# Altium project ELC102 - Scoreboard.PrjPcb (part 3 of 3)

## Sheet ELC102 - Red Digits.SchDoc: ELC102 - NEOS Scoreboard
size C
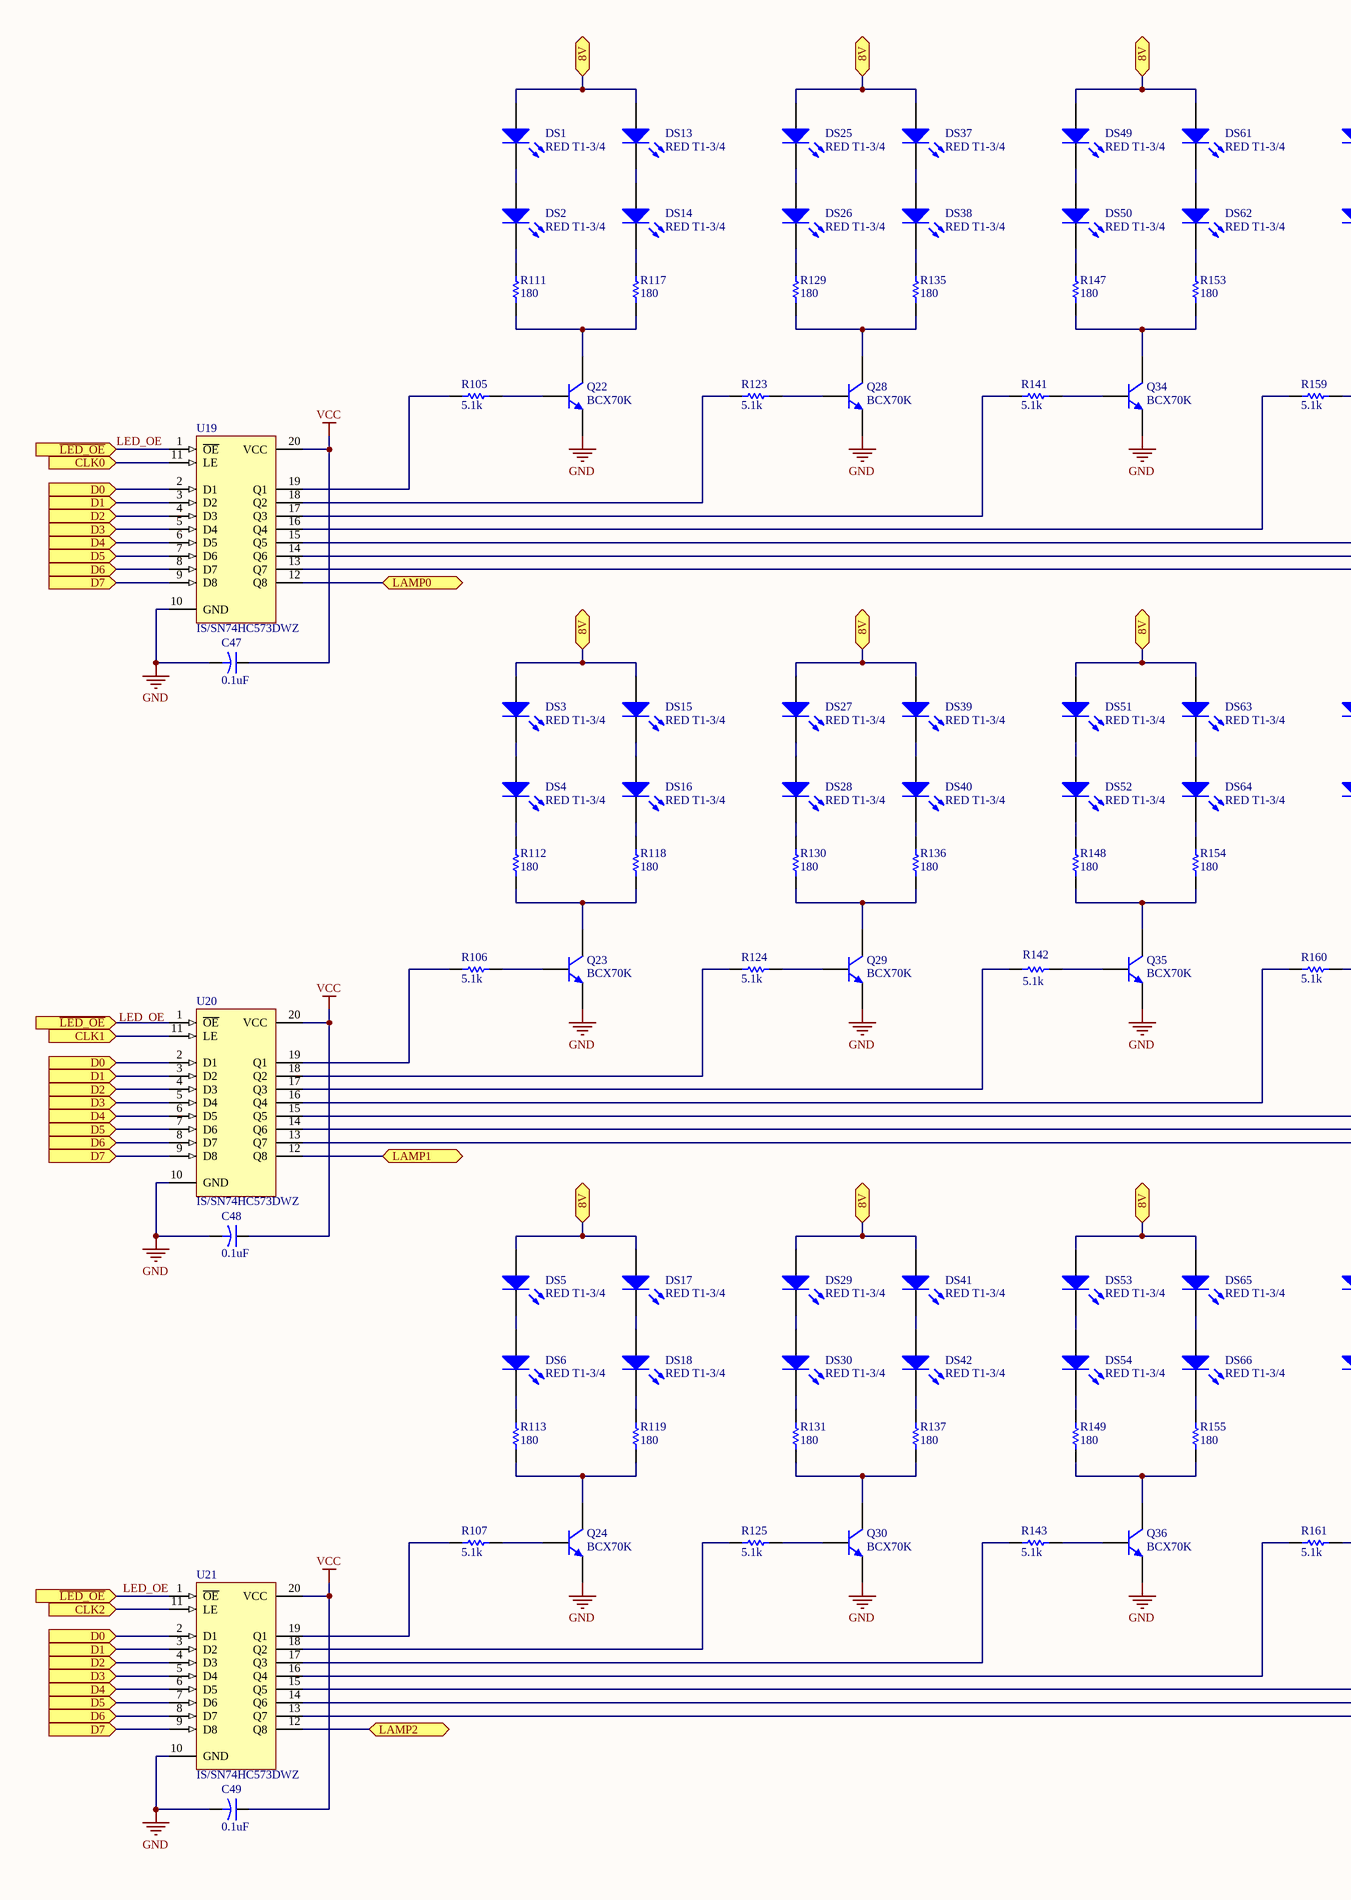
[diagram p6: ELC102 - Red Digits.SchDoc, left]
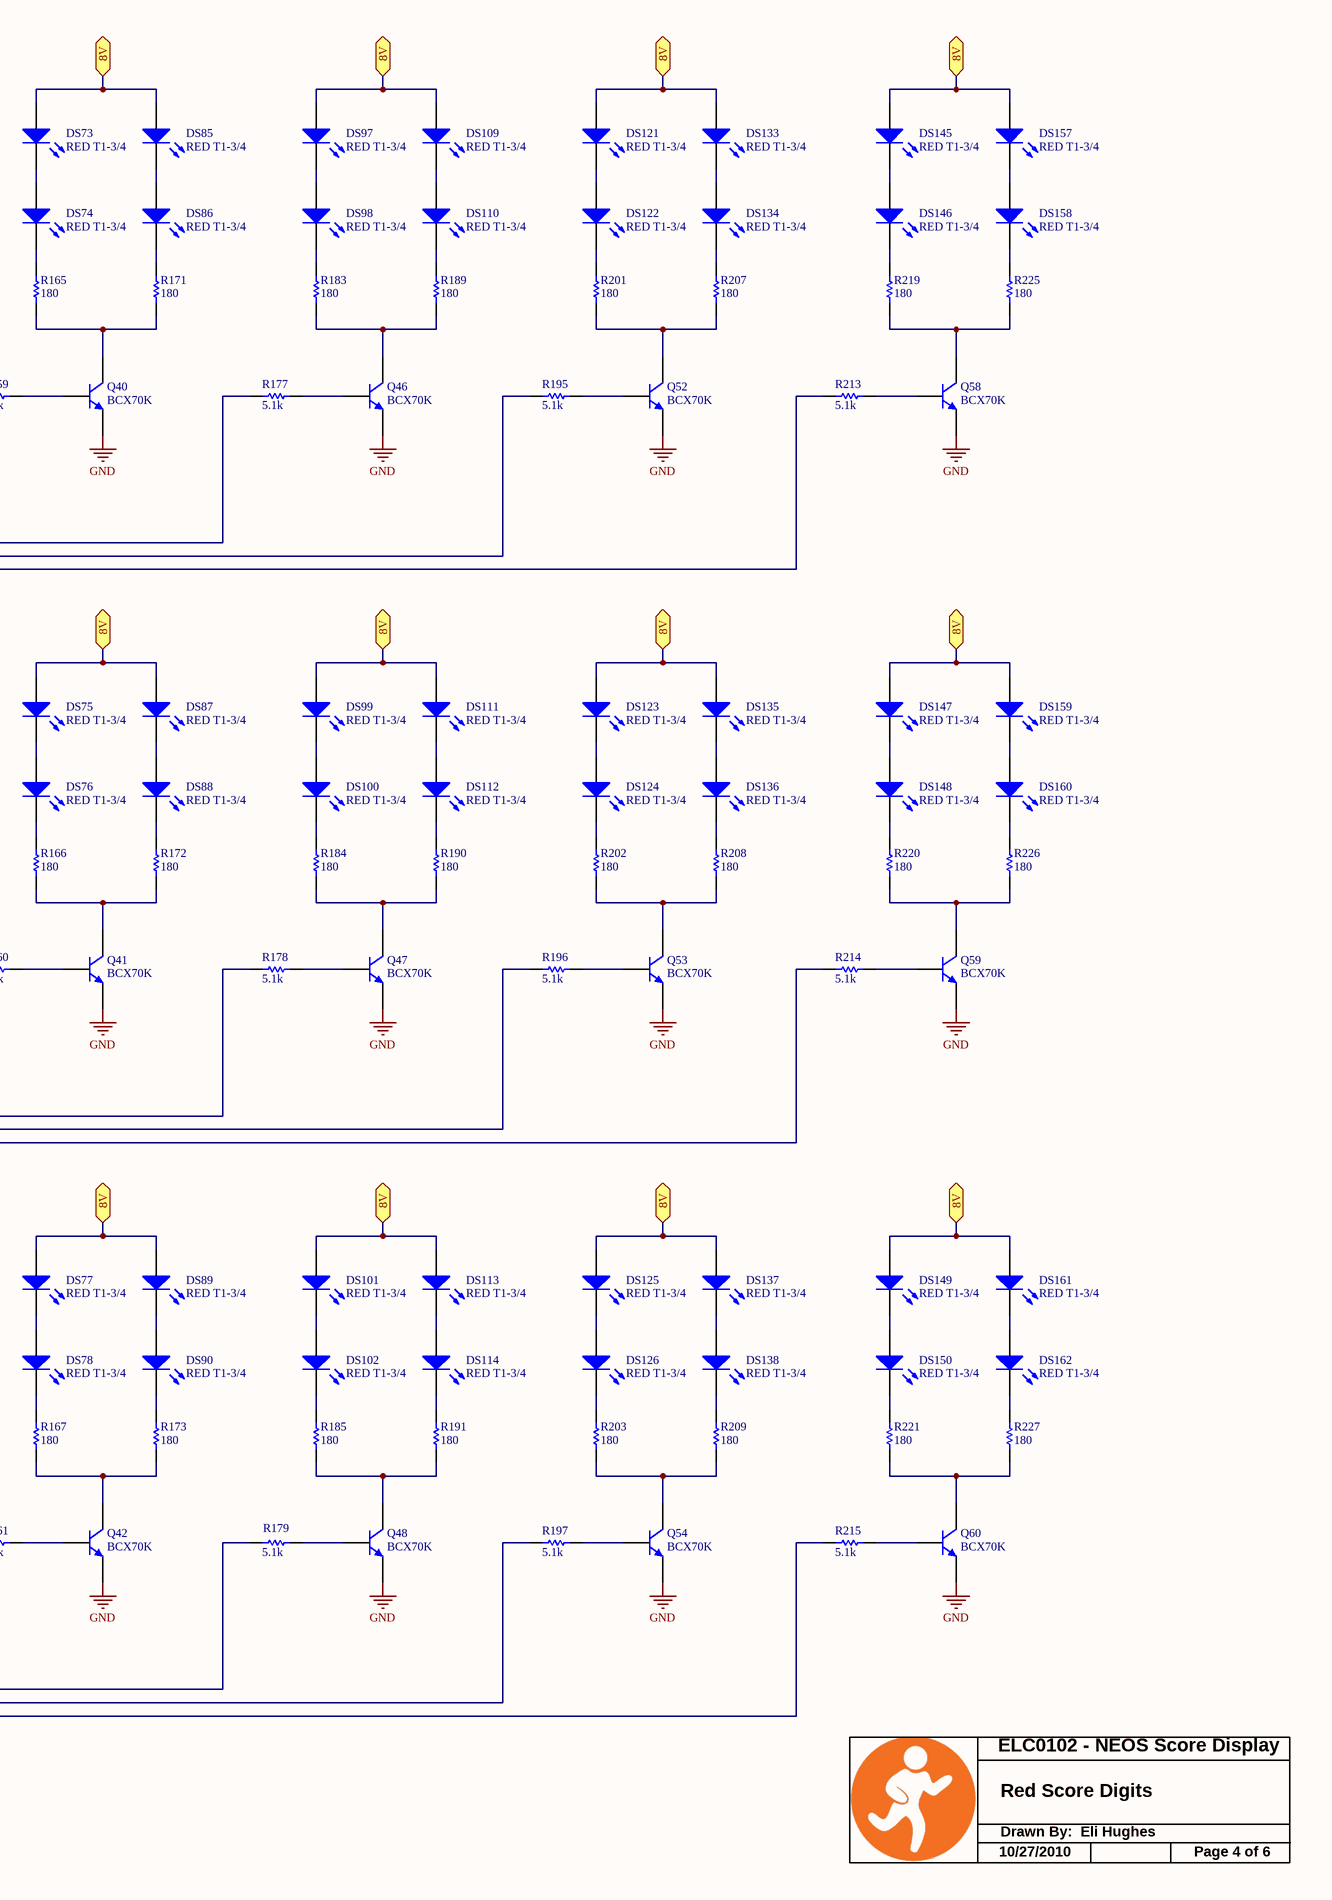
[diagram p7: ELC102 - Red Digits.SchDoc, right]

### Parts
C47  0.1uF  [C0805]
C48  0.1uF  [C0805]
C49  0.1uF  [C0805]
DS1  RED T1-3/4  [LED T1-3/4 Flush]
DS2  RED T1-3/4  [LED T1-3/4 Flush]
DS3  RED T1-3/4  [LED T1-3/4 Flush]
DS4  RED T1-3/4  [LED T1-3/4 Flush]
DS5  RED T1-3/4  [LED T1-3/4 Flush]
DS6  RED T1-3/4  [LED T1-3/4 Flush]
DS13  RED T1-3/4  [LED T1-3/4 Flush]
DS14  RED T1-3/4  [LED T1-3/4 Flush]
DS15  RED T1-3/4  [LED T1-3/4 Flush]
DS16  RED T1-3/4  [LED T1-3/4 Flush]
DS17  RED T1-3/4  [LED T1-3/4 Flush]
DS18  RED T1-3/4  [LED T1-3/4 Flush]
DS25  RED T1-3/4  [LED T1-3/4 Flush]
DS26  RED T1-3/4  [LED T1-3/4 Flush]
DS27  RED T1-3/4  [LED T1-3/4 Flush]
DS28  RED T1-3/4  [LED T1-3/4 Flush]
DS29  RED T1-3/4  [LED T1-3/4 Flush]
DS30  RED T1-3/4  [LED T1-3/4 Flush]
DS37  RED T1-3/4  [LED T1-3/4 Flush]
DS38  RED T1-3/4  [LED T1-3/4 Flush]
DS39  RED T1-3/4  [LED T1-3/4 Flush]
DS40  RED T1-3/4  [LED T1-3/4 Flush]
DS41  RED T1-3/4  [LED T1-3/4 Flush]
DS42  RED T1-3/4  [LED T1-3/4 Flush]
DS49  RED T1-3/4  [LED T1-3/4 Flush]
DS50  RED T1-3/4  [LED T1-3/4 Flush]
DS51  RED T1-3/4  [LED T1-3/4 Flush]
DS52  RED T1-3/4  [LED T1-3/4 Flush]
DS53  RED T1-3/4  [LED T1-3/4 Flush]
DS54  RED T1-3/4  [LED T1-3/4 Flush]
DS61  RED T1-3/4  [LED T1-3/4 Flush]
DS62  RED T1-3/4  [LED T1-3/4 Flush]
DS63  RED T1-3/4  [LED T1-3/4 Flush]
DS64  RED T1-3/4  [LED T1-3/4 Flush]
DS65  RED T1-3/4  [LED T1-3/4 Flush]
DS66  RED T1-3/4  [LED T1-3/4 Flush]
DS73  RED T1-3/4  [LED T1-3/4 Flush]
DS74  RED T1-3/4  [LED T1-3/4 Flush]
DS75  RED T1-3/4  [LED T1-3/4 Flush]
DS76  RED T1-3/4  [LED T1-3/4 Flush]
DS77  RED T1-3/4  [LED T1-3/4 Flush]
DS78  RED T1-3/4  [LED T1-3/4 Flush]
DS85  RED T1-3/4  [LED T1-3/4 Flush]
DS86  RED T1-3/4  [LED T1-3/4 Flush]
DS87  RED T1-3/4  [LED T1-3/4 Flush]
DS88  RED T1-3/4  [LED T1-3/4 Flush]
DS89  RED T1-3/4  [LED T1-3/4 Flush]
DS90  RED T1-3/4  [LED T1-3/4 Flush]
DS97  RED T1-3/4  [LED T1-3/4 Flush]
DS98  RED T1-3/4  [LED T1-3/4 Flush]
DS99  RED T1-3/4  [LED T1-3/4 Flush]
DS100  RED T1-3/4  [LED T1-3/4 Flush]
DS101  RED T1-3/4  [LED T1-3/4 Flush]
DS102  RED T1-3/4  [LED T1-3/4 Flush]
DS109  RED T1-3/4  [LED T1-3/4 Flush]
DS110  RED T1-3/4  [LED T1-3/4 Flush]
DS111  RED T1-3/4  [LED T1-3/4 Flush]
DS112  RED T1-3/4  [LED T1-3/4 Flush]
DS113  RED T1-3/4  [LED T1-3/4 Flush]
DS114  RED T1-3/4  [LED T1-3/4 Flush]
DS121  RED T1-3/4  [LED T1-3/4 Flush]
DS122  RED T1-3/4  [LED T1-3/4 Flush]
DS123  RED T1-3/4  [LED T1-3/4 Flush]
DS124  RED T1-3/4  [LED T1-3/4 Flush]
DS125  RED T1-3/4  [LED T1-3/4 Flush]
DS126  RED T1-3/4  [LED T1-3/4 Flush]
DS133  RED T1-3/4  [LED T1-3/4 Flush]
DS134  RED T1-3/4  [LED T1-3/4 Flush]
DS135  RED T1-3/4  [LED T1-3/4 Flush]
DS136  RED T1-3/4  [LED T1-3/4 Flush]
DS137  RED T1-3/4  [LED T1-3/4 Flush]
DS138  RED T1-3/4  [LED T1-3/4 Flush]
DS145  RED T1-3/4  [LED T1-3/4 Flush]
DS146  RED T1-3/4  [LED T1-3/4 Flush]
DS147  RED T1-3/4  [LED T1-3/4 Flush]
DS148  RED T1-3/4  [LED T1-3/4 Flush]
DS149  RED T1-3/4  [LED T1-3/4 Flush]
DS150  RED T1-3/4  [LED T1-3/4 Flush]
DS157  RED T1-3/4  [LED T1-3/4 Flush]
DS158  RED T1-3/4  [LED T1-3/4 Flush]
DS159  RED T1-3/4  [LED T1-3/4 Flush]
DS160  RED T1-3/4  [LED T1-3/4 Flush]
DS161  RED T1-3/4  [LED T1-3/4 Flush]
DS162  RED T1-3/4  [LED T1-3/4 Flush]
Q22  BCX70K  [SOT23]
Q23  BCX70K  [SOT23]
Q24  BCX70K  [SOT23]
Q28  BCX70K  [SOT23]
Q29  BCX70K  [SOT23]
Q30  BCX70K  [SOT23]
Q34  BCX70K  [SOT23]
Q35  BCX70K  [SOT23]
Q36  BCX70K  [SOT23]
Q40  BCX70K  [SOT23]
Q41  BCX70K  [SOT23]
Q42  BCX70K  [SOT23]
Q46  BCX70K  [SOT23]
Q47  BCX70K  [SOT23]
Q48  BCX70K  [SOT23]
Q52  BCX70K  [SOT23]
Q53  BCX70K  [SOT23]
Q54  BCX70K  [SOT23]
Q58  BCX70K  [SOT23]
Q59  BCX70K  [SOT23]
Q60  BCX70K  [SOT23]
R105  5.1k  [R0805]
R106  5.1k  [R0805]
R107  5.1k  [R0805]
R111  180  [R1206]
R112  180  [R1206]
R113  180  [R1206]
R117  180  [R1206]
R118  180  [R1206]
R119  180  [R1206]
R123  5.1k  [R0805]
R124  5.1k  [R0805]
R125  5.1k  [R0805]
R129  180  [R1206]
R130  180  [R1206]
R131  180  [R1206]
R135  180  [R1206]
R136  180  [R1206]
R137  180  [R1206]
R141  5.1k  [R0805]
R142  5.1k  [R0805]
R143  5.1k  [R0805]
R147  180  [R1206]
R148  180  [R1206]
R149  180  [R1206]
R153  180  [R1206]
R154  180  [R1206]
R155  180  [R1206]
R159  5.1k  [R0805]
R160  5.1k  [R0805]
R161  5.1k  [R0805]
R165  180  [R1206]
R166  180  [R1206]
R167  180  [R1206]
R171  180  [R1206]
R172  180  [R1206]
R173  180  [R1206]
R177  5.1k  [R0805]
R178  5.1k  [R0805]
R179  5.1k  [R0805]
R183  180  [R1206]
R184  180  [R1206]
R185  180  [R1206]
R189  180  [R1206]
R190  180  [R1206]
R191  180  [R1206]
R195  5.1k  [R0805]
R196  5.1k  [R0805]
R197  5.1k  [R0805]
R201  180  [R1206]
R202  180  [R1206]
R203  180  [R1206]
R207  180  [R1206]
R208  180  [R1206]
R209  180  [R1206]
R213  5.1k  [R0805]
R214  5.1k  [R0805]
R215  5.1k  [R0805]
R219  180  [R1206]
R220  180  [R1206]
R221  180  [R1206]
R225  180  [R1206]
R226  180  [R1206]
R227  180  [R1206]
U19  IS/SN74HC573DWZ  [SOIC300-20]
U20  IS/SN74HC573DWZ  [SOIC300-20]
U21  IS/SN74HC573DWZ  [SOIC300-20]

### Ports
8V, CLK0 (in), CLK1 (in), CLK2 (in), D0 (in), D1 (in), D2 (in), D3 (in), D4 (in), D5 (in), D6 (in), D7 (in), LAMP0, LAMP1, LAMP2, ~{LED_OE} (in)

### Nets
GND: C47.2 C48.2 C49.2 Q22.2(E) Q23.2(E) Q24.2(E) Q28.2(E) Q29.2(E) Q30.2(E) Q34.2(E) Q35.2(E) Q36.2(E) Q40.2(E) Q41.2(E) Q42.2(E) Q46.2(E) Q47.2(E) Q48.2(E) Q52.2(E) Q53.2(E) Q54.2(E) Q58.2(E) Q59.2(E) Q60.2(E) U19.10(GND) U20.10(GND) U21.10(GND)
VCC: C47.1 C48.1 C49.1 U19.20(VCC) U20.20(VCC) U21.20(VCC)  [project net +3.3 VDC]
8V: DS1.1(A) DS3.1(A) DS5.1(A) DS13.1(A) DS15.1(A) DS17.1(A) DS25.1(A) DS27.1(A) DS29.1(A) DS37.1(A) DS39.1(A) DS41.1(A) DS49.1(A) DS51.1(A) DS53.1(A) DS61.1(A) DS63.1(A) DS65.1(A) DS73.1(A) DS75.1(A) DS77.1(A) DS85.1(A) DS87.1(A) DS89.1(A) DS97.1(A) DS99.1(A) DS101.1(A) DS109.1(A) DS111.1(A) DS113.1(A) DS121.1(A) DS123.1(A) DS125.1(A) DS133.1(A) DS135.1(A) DS137.1(A) DS145.1(A) DS147.1(A) DS149.1(A) DS157.1(A) DS159.1(A) DS161.1(A) ; port 8V
CLK0: U19.11(LE) ; port CLK0
CLK1: U20.11(LE) ; port CLK1
CLK2: U21.11(LE) ; port CLK2
D0: U19.2(D1) U20.2(D1) U21.2(D1) ; port D0
D1: U19.3(D2) U20.3(D2) U21.3(D2) ; port D1
D2: U19.4(D3) U20.4(D3) U21.4(D3) ; port D2
D3: U19.5(D4) U20.5(D4) U21.5(D4) ; port D3
D4: U19.6(D5) U20.6(D5) U21.6(D5) ; port D4
D5: U19.7(D6) U20.7(D6) U21.7(D6) ; port D5
D6: U19.8(D7) U20.8(D7) U21.8(D7) ; port D6
D7: U19.9(D8) U20.9(D8) U21.9(D8) ; port D7
LAMP0: U19.12(Q8) ; port LAMP0
LAMP1: U20.12(Q8) ; port LAMP1
LAMP2: U21.12(Q8) ; port LAMP2
LED_OE: U19.1(~{OE}) U20.1(~{OE}) U21.1(~{OE}) ; port ~{LED_OE}
NetDS1_2: DS1.2(K) DS2.1(A)
NetDS2_2: DS2.2(K) R111.2
NetDS3_2: DS3.2(K) DS4.1(A)
NetDS4_2: DS4.2(K) R112.2
NetDS5_2: DS5.2(K) DS6.1(A)
NetDS6_2: DS6.2(K) R113.2
NetDS13_2: DS13.2(K) DS14.1(A)
NetDS14_2: DS14.2(K) R117.2
NetDS15_2: DS15.2(K) DS16.1(A)
NetDS16_2: DS16.2(K) R118.2
NetDS17_2: DS17.2(K) DS18.1(A)
NetDS18_2: DS18.2(K) R119.2
NetDS25_2: DS25.2(K) DS26.1(A)
NetDS26_2: DS26.2(K) R129.2
NetDS27_2: DS27.2(K) DS28.1(A)
NetDS28_2: DS28.2(K) R130.2
NetDS29_2: DS29.2(K) DS30.1(A)
NetDS30_2: DS30.2(K) R131.2
NetDS37_2: DS37.2(K) DS38.1(A)
NetDS38_2: DS38.2(K) R135.2
NetDS39_2: DS39.2(K) DS40.1(A)
NetDS40_2: DS40.2(K) R136.2
NetDS41_2: DS41.2(K) DS42.1(A)
NetDS42_2: DS42.2(K) R137.2
NetDS49_2: DS49.2(K) DS50.1(A)
NetDS50_2: DS50.2(K) R147.2
NetDS51_2: DS51.2(K) DS52.1(A)
NetDS52_2: DS52.2(K) R148.2
NetDS53_2: DS53.2(K) DS54.1(A)
NetDS54_2: DS54.2(K) R149.2
NetDS61_2: DS61.2(K) DS62.1(A)
NetDS62_2: DS62.2(K) R153.2
NetDS63_2: DS63.2(K) DS64.1(A)
NetDS64_2: DS64.2(K) R154.2
NetDS65_2: DS65.2(K) DS66.1(A)
NetDS66_2: DS66.2(K) R155.2
NetDS73_2: DS73.2(K) DS74.1(A)
NetDS74_2: DS74.2(K) R165.2
NetDS75_2: DS75.2(K) DS76.1(A)
NetDS76_2: DS76.2(K) R166.2
NetDS77_2: DS77.2(K) DS78.1(A)
NetDS78_2: DS78.2(K) R167.2
NetDS85_2: DS85.2(K) DS86.1(A)
NetDS86_2: DS86.2(K) R171.2
NetDS87_2: DS87.2(K) DS88.1(A)
NetDS88_2: DS88.2(K) R172.2
NetDS89_2: DS89.2(K) DS90.1(A)
NetDS90_2: DS90.2(K) R173.2
NetDS97_2: DS97.2(K) DS98.1(A)
NetDS98_2: DS98.2(K) R183.2
NetDS99_2: DS99.2(K) DS100.1(A)
NetDS100_2: DS100.2(K) R184.2
NetDS101_2: DS101.2(K) DS102.1(A)
NetDS102_2: DS102.2(K) R185.2
NetDS109_2: DS109.2(K) DS110.1(A)
NetDS110_2: DS110.2(K) R189.2
NetDS111_2: DS111.2(K) DS112.1(A)
NetDS112_2: DS112.2(K) R190.2
NetDS113_2: DS113.2(K) DS114.1(A)
NetDS114_2: DS114.2(K) R191.2
NetDS121_2: DS121.2(K) DS122.1(A)
NetDS122_2: DS122.2(K) R201.2
NetDS123_2: DS123.2(K) DS124.1(A)
NetDS124_2: DS124.2(K) R202.2
NetDS125_2: DS125.2(K) DS126.1(A)
NetDS126_2: DS126.2(K) R203.2
NetDS133_2: DS133.2(K) DS134.1(A)
NetDS134_2: DS134.2(K) R207.2
NetDS135_2: DS135.2(K) DS136.1(A)
NetDS136_2: DS136.2(K) R208.2
NetDS137_2: DS137.2(K) DS138.1(A)
NetDS138_2: DS138.2(K) R209.2
NetDS145_2: DS145.2(K) DS146.1(A)
NetDS146_2: DS146.2(K) R219.2
NetDS147_2: DS147.2(K) DS148.1(A)
NetDS148_2: DS148.2(K) R220.2
NetDS149_2: DS149.2(K) DS150.1(A)
NetDS150_2: DS150.2(K) R221.2
NetDS157_2: DS157.2(K) DS158.1(A)
NetDS158_2: DS158.2(K) R225.2
NetDS159_2: DS159.2(K) DS160.1(A)
NetDS160_2: DS160.2(K) R226.2
NetDS161_2: DS161.2(K) DS162.1(A)
NetDS162_2: DS162.2(K) R227.2
NetQ22_1: Q22.1(B) R105.2
NetQ22_3: Q22.3(C) R111.1 R117.1
NetQ23_1: Q23.1(B) R106.2
NetQ23_3: Q23.3(C) R112.1 R118.1
NetQ24_1: Q24.1(B) R107.2
NetQ24_3: Q24.3(C) R113.1 R119.1
NetQ28_1: Q28.1(B) R123.2
NetQ28_3: Q28.3(C) R129.1 R135.1
NetQ29_1: Q29.1(B) R124.2
NetQ29_3: Q29.3(C) R130.1 R136.1
NetQ30_1: Q30.1(B) R125.2
NetQ30_3: Q30.3(C) R131.1 R137.1
NetQ34_1: Q34.1(B) R141.2
NetQ34_3: Q34.3(C) R147.1 R153.1
NetQ35_1: Q35.1(B) R142.2
NetQ35_3: Q35.3(C) R148.1 R154.1
NetQ36_1: Q36.1(B) R143.2
NetQ36_3: Q36.3(C) R149.1 R155.1
NetQ40_1: Q40.1(B) R159.2
NetQ40_3: Q40.3(C) R165.1 R171.1
NetQ41_1: Q41.1(B) R160.2
NetQ41_3: Q41.3(C) R166.1 R172.1
NetQ42_1: Q42.1(B) R161.2
NetQ42_3: Q42.3(C) R167.1 R173.1
NetQ46_1: Q46.1(B) R177.2
NetQ46_3: Q46.3(C) R183.1 R189.1
NetQ47_1: Q47.1(B) R178.2
NetQ47_3: Q47.3(C) R184.1 R190.1
NetQ48_1: Q48.1(B) R179.2
NetQ48_3: Q48.3(C) R185.1 R191.1
NetQ52_1: Q52.1(B) R195.2
NetQ52_3: Q52.3(C) R201.1 R207.1
NetQ53_1: Q53.1(B) R196.2
NetQ53_3: Q53.3(C) R202.1 R208.1
NetQ54_1: Q54.1(B) R197.2
NetQ54_3: Q54.3(C) R203.1 R209.1
NetQ58_1: Q58.1(B) R213.2
NetQ58_3: Q58.3(C) R219.1 R225.1
NetQ59_1: Q59.1(B) R214.2
NetQ59_3: Q59.3(C) R220.1 R226.1
NetQ60_1: Q60.1(B) R215.2
NetQ60_3: Q60.3(C) R221.1 R227.1
NetR105_1: R105.1 U19.19(Q1)
NetR106_1: R106.1 U20.19(Q1)
NetR107_1: R107.1 U21.19(Q1)
NetR123_1: R123.1 U19.18(Q2)
NetR124_1: R124.1 U20.18(Q2)
NetR125_1: R125.1 U21.18(Q2)
NetR141_1: R141.1 U19.17(Q3)
NetR142_1: R142.1 U20.17(Q3)
NetR143_1: R143.1 U21.17(Q3)
NetR159_1: R159.1 U19.16(Q4)
NetR160_1: R160.1 U20.16(Q4)
NetR161_1: R161.1 U21.16(Q4)
NetR177_1: R177.1 U19.15(Q5)
NetR178_1: R178.1 U20.15(Q5)
NetR179_1: R179.1 U21.15(Q5)
NetR195_1: R195.1 U19.14(Q6)
NetR196_1: R196.1 U20.14(Q6)
NetR197_1: R197.1 U21.14(Q6)
NetR213_1: R213.1 U19.13(Q7)
NetR214_1: R214.1 U20.13(Q7)
NetR215_1: R215.1 U21.13(Q7)

### Notes on the sheet
- ELC0102 - NEOS Score Display
- Red Score Digits
- 10/27/2010
- Drawn By:  Eli Hughes
- Page 4 of 6
- Labels drawn without touching a wire or pin: LED_OE

### Library data of the parts
C47-C49 = CS/C0805C104K5RACK: CAP .10UF 50V CERAMIC X7R 0805; Manufacturer: Kemet; Manufacturer Part Number: C0805C104K5RACTU; Source Part Number: 399-1170-2-ND; Capacitance: 0.1µF; Tolerance: ±10%; ROHS Certificate: Lead free / RoHS compliant; Source: Digikey; Value: 0.1uF; Supplier 1: Digi-Key; RoHS: RoHS Compliant; Category: Capacitors; Stock 1: 10120790; Pricing 1: 10=0.105, 100=0.0378, 250=0.02732, 500=0.02016, 1000=0.01365 (USD); Voltage - Rated: 50V; Temperature Coefficient: X7R; Mounting Type: Surface Mount, MLCC; Operating Temperature: -55°C ~ 125°C; Features: -; Applications: General Purpose; Ratings: -; Package / Case: 0805 (2012 Metric); Size / Dimension: 0.079" L x 0.049" W (2.00mm x 1.25mm); Lead Spacing: -; Thickness: 0.90mm; Packaging: Cut Tape (CT); Lead Style: -; ComponentLink1URL: http://www.kemet.com/datasheets&C0805C104K5RACTU; ComponentLink1Description: http://www.kemet.com/datasheets&C0805C104K5RACTU; Supplier Part Number 1: 399-1170-1-ND
DS1-DS6 DS13-DS18 DS25-DS30 DS37-DS42 DS49-DS54 DS61-DS66 DS73-DS78 DS85-DS90 DS97-DS102 DS109-DS114 DS121-DS126 DS133-DS138 DS145-DS150 DS157-DS162 = LRCOVLFR3C7Z: Optek LED Red /Clear High Brightness T1-3/4; Manufacturer: TT Electronics/Optek Technology; Source Part Number: 365-1182-ND; Description: LED 623NM ROUND RED 5MM; Current - Test: 20mA; Wavelength - Dominant: 623nm; Wavelength - Peak: 633nm; Millicandela Rating: 5000mcd; Voltage - Forward (Vf) Typ: 2.2V; Lens Type: Clear; Lens Style/Size: Round, 5mm, T-1 3/4; Viewing Angle: 30°; Manufacturer Part Number: OVLFR3C7; ROHS Certificate: Lead free / RoHS compliant; Source: Digikey; Value: OVLFR3C7; Supplier 1: Digi-Key; RoHS: RoHS Compliant; Category: Optoelectronics; Stock 1: 14474; Pricing 1: 1=0.3, 100=0.16, 250=0.15, 10000=0.14 (USD); Color: Red; Luminous Flux @ Current - Test: -; Package / Case: Radial - 2 Lead; Mounting Type: Through Hole; Packaging: Bulk; ComponentLink1URL: http://media.digikey.com/pdf/Data%20Sheets/Optek%20PDFs/OVLFB3C7.pdf; ComponentLink1Description: http://media.digikey.com/pdf/Data%20Sheets/Optek%20PDFs/OVLFB3C7.pdf; Supplier Part Number 1: 365-1182-ND
Q22-Q24 Q28-Q30 Q34-Q36 Q40-Q42 Q46-Q48 Q52-Q54 Q58-Q60 = QS/BCX70K00Z: NPN SOT23 Silicon Planar Small Signal Transistor; Manufacturer: Fairchild Semiconductor; Source Part Number: BCX70K-ND; Description: TRANS NPN AF 45V SOT-23; Current - Collector (Ic) (Max): 100mA; Voltage - Collector Emitter Breakdown (Max): 45V; Vce Saturation (Max) @ Ib, Ic: 550mV @ 1.25mA, 50mA; DC Current Gain (hFE) (Min) @ Ic, Vce: 380 @ 2mA, 5V; Power - Max: 330mW; Frequency - Transition: 250MHz; Manufacturer Part Number: BCX70K; ROHS Certificate: Lead free / RoHS compliant; Source: Digikey; Value: BCX70K; Supplier 1: Digi-Key; RoHS: RoHS Compliant; Category: Discrete Semiconductor Products; Stock 1: 69796; Pricing 1: 1=0.5, 10=0.331, 100=0.144, 500=0.06624, 1000=0.0468 (USD); Transistor Type: NPN; Current - Collector Cutoff (Max): -; Mounting Type: Surface Mount; Package / Case: SOT-23-3, TO-236-3, Micro3™, SSD3, SST3; Packaging: Cut Tape (CT); Supplier Device Package: SOT-23; ComponentLink1URL: http://www.infineon.com/dgdl/bcw60_bcx70.pdf?folderId=db3a304412b407950112b43286c05890&fileId=db3a304412b407950112b43287355891; ComponentLink1Description: http://www.infineon.com/dgdl/bcw60_bcx70.pdf?folderId=db3a304412b407950112b43286c05890&fileId=db3a304412b407950112b43287355891; Supplier Part Number 1: BCX70KINCT-ND
R105-R107 R123-R125 R141-R143 R159-R161 R177-R179 R195-R197 R213-R215 = ERJ-6ENF5101V: RES 5.10K OHM 1/8W 1% 0805 SMD; Manufacturer: Panasonic - ECG; Power (Watts): 0.125W, 1/8W; Temperature Coefficient: ±100ppm/°C; ComponentLink1Description: http://industrial.panasonic.com/www-cgi/jvcr13pz.cgi?E+PZ+3+AOA0002+ERJ6ENF5101V+7+WW; ComponentLink1URL: http://industrial.panasonic.com/www-cgi/jvcr13pz.cgi?E+PZ+3+AOA0002+ERJ6ENF5101V+7+WW; Value: 5.1k; Supplier 1: Digi-Key; Manufacturer Part Number: ERJ-6ENF5101V; RoHS: RoHS Compliant; Category: Resistors; Stock 1: 32293; Pricing 1: 1=0.07, 50=0.0276, 100=0.021, 250=0.0156, 500=0.01152, 1000=0.00768 (USD); Resistance In Ohms: 5.10K; Composition: Thick Film; Features: -; Tolerance: ±1%; Case: 0805 (2012 metric); Size / Dimension: 0.079" L x 0.049" W (2.00mm x 1.25mm); Height: 0.024" (0.60mm); Lead Style: Surface Mount (SMD - SMT); Packaging: Digi-Reel®; Supplier Part Number 1: P5.10KCDKR-ND
R111-R113 R117-R119 R129-R131 R135-R137 R147-R149 R153-R155 R165-R167 R171-R173 R183-R185 R189-R191 R201-R203 R207-R209 R219-R221 R225-R227 = ERJ-8ENF1800V: RES 180 OHM 1/4W 1% 1206 SMD; Manufacturer: Panasonic - ECG; Power (Watts): 0.25W, 1/4W; Temperature Coefficient: ±100ppm/°C; Value: 180; Manufacturer Part Number: ERJ-8ENF1800V; Supplier 1: Digi-Key; Supplier Part Number 1: P180FTR-ND; RoHS: RoHS Compliant; Category: Resistors; Stock 1: 45000; Pricing 1: 5000=0.006, 10000=0.005, 25000=0.005 (USD); Resistance In Ohms: 180; Composition: Thick Film; Features: -; Tolerance: ±1%; Case: 1206 (3216 metric); Size / Dimension: 0.126" L x 0.063" W (3.20mm x 1.60mm); Height: 0.024" (0.60mm); Lead Style: Surface Mount (SMD - SMT); Packaging: Tape & Reel (TR); ComponentLink1URL: http://industrial.panasonic.com/www-cgi/jvcr13pz.cgi?E+PZ+3+AOA0002+ERJ8ENF1800V+7+WW; ComponentLink1Description: http://industrial.panasonic.com/www-cgi/jvcr13pz.cgi?E+PZ+3+AOA0002+ERJ8ENF1800V+7+WW
U19-U21 = IS/SN74HC573DWZ: Octal D-Type Transparent Latch with 3-State Outputs; Manufacturer: NXP Semiconductors; Manufacturer Part Number: 74HC573D-T; Source Part Number: 568-1477-2-ND; Value: 74HC573D-T; Description: IC LATCH OCTAL D 3STATE 20SOIC; Circuit: 8:8; Output Type: Tri-State; Voltage - Supply: 2 V ~ 6 V; Independent Circuits: 1; Delay Time - Propagation: 14ns; Current - Output High, Low: 7.8mA, 7.8mA; ROHS Certificate: Lead free / RoHS compliant; Source: Digikey; Supplier 1: Digi-Key; RoHS: RoHS Compliant; Category: Integrated Circuits (ICs); Stock 1: 46803; Pricing 1: 1=0.84, 25=0.646, 100=0.57, 250=0.494, 500=0.418 (USD); Logic Type: D-Type Transparent Latch; Operating Temperature: -40°C ~ 125°C; Mounting Type: Surface Mount; Package / Case: 20-SOIC (0.300", 7.50mm Width); Packaging: Cut Tape (CT); Supplier Device Package: 20-SOIC; ComponentLink1URL: http://www.nxp.com/documents/data_sheet/74HC_HCT573.pdf; ComponentLink1Description: http://www.nxp.com/documents/data_sheet/74HC_HCT573.pdf; Supplier Part Number 1: 568-1477-1-ND

## Sheet ELC102 - Switch Interface.SchDoc: ELC102 - NEOS Scoreboard
size D
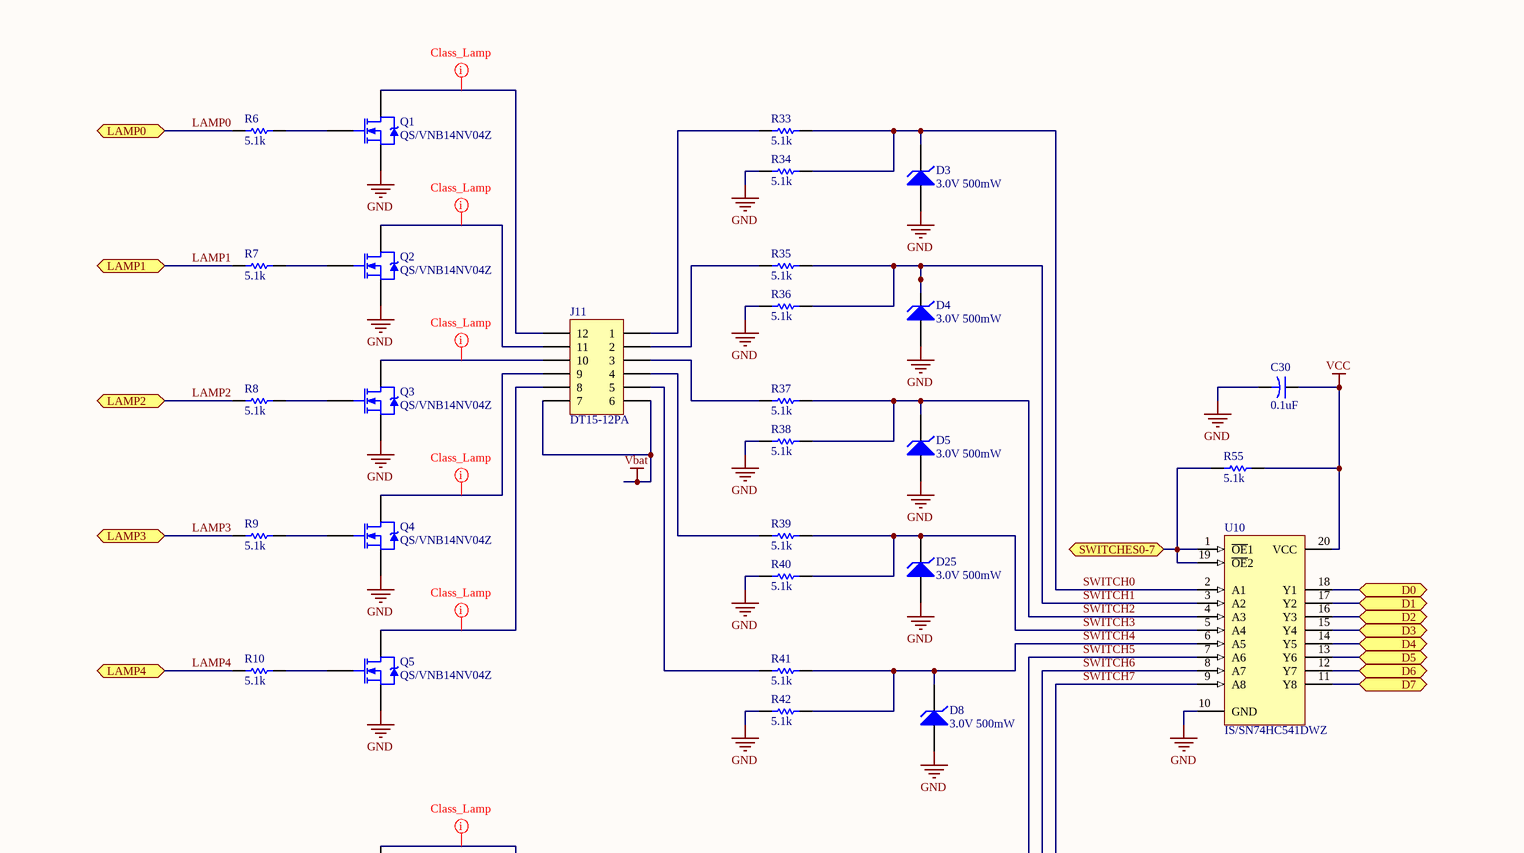
[diagram p8: ELC102 - Switch Interface.SchDoc, top left]
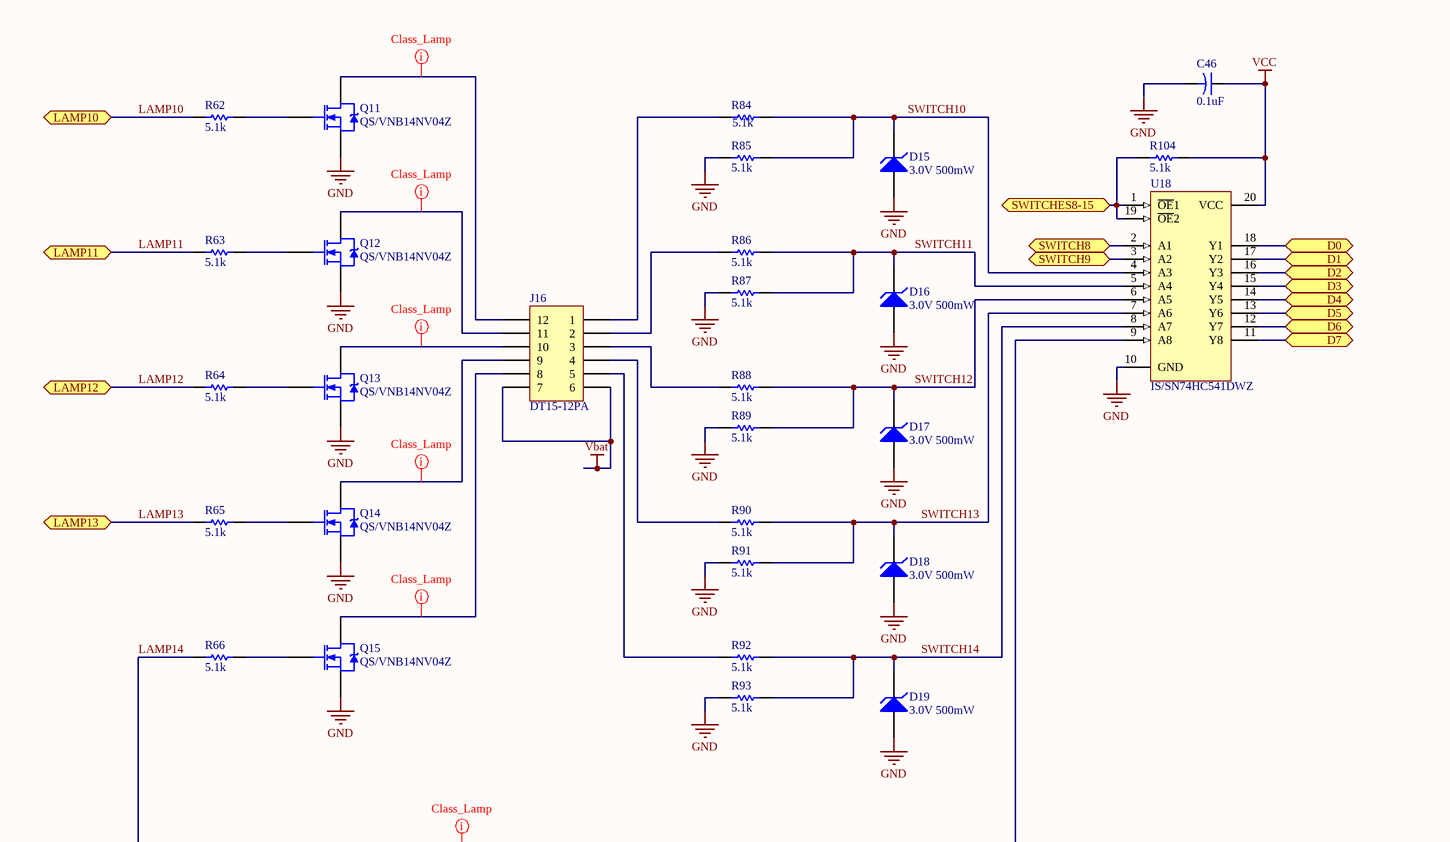
[diagram p9: ELC102 - Switch Interface.SchDoc, top right]
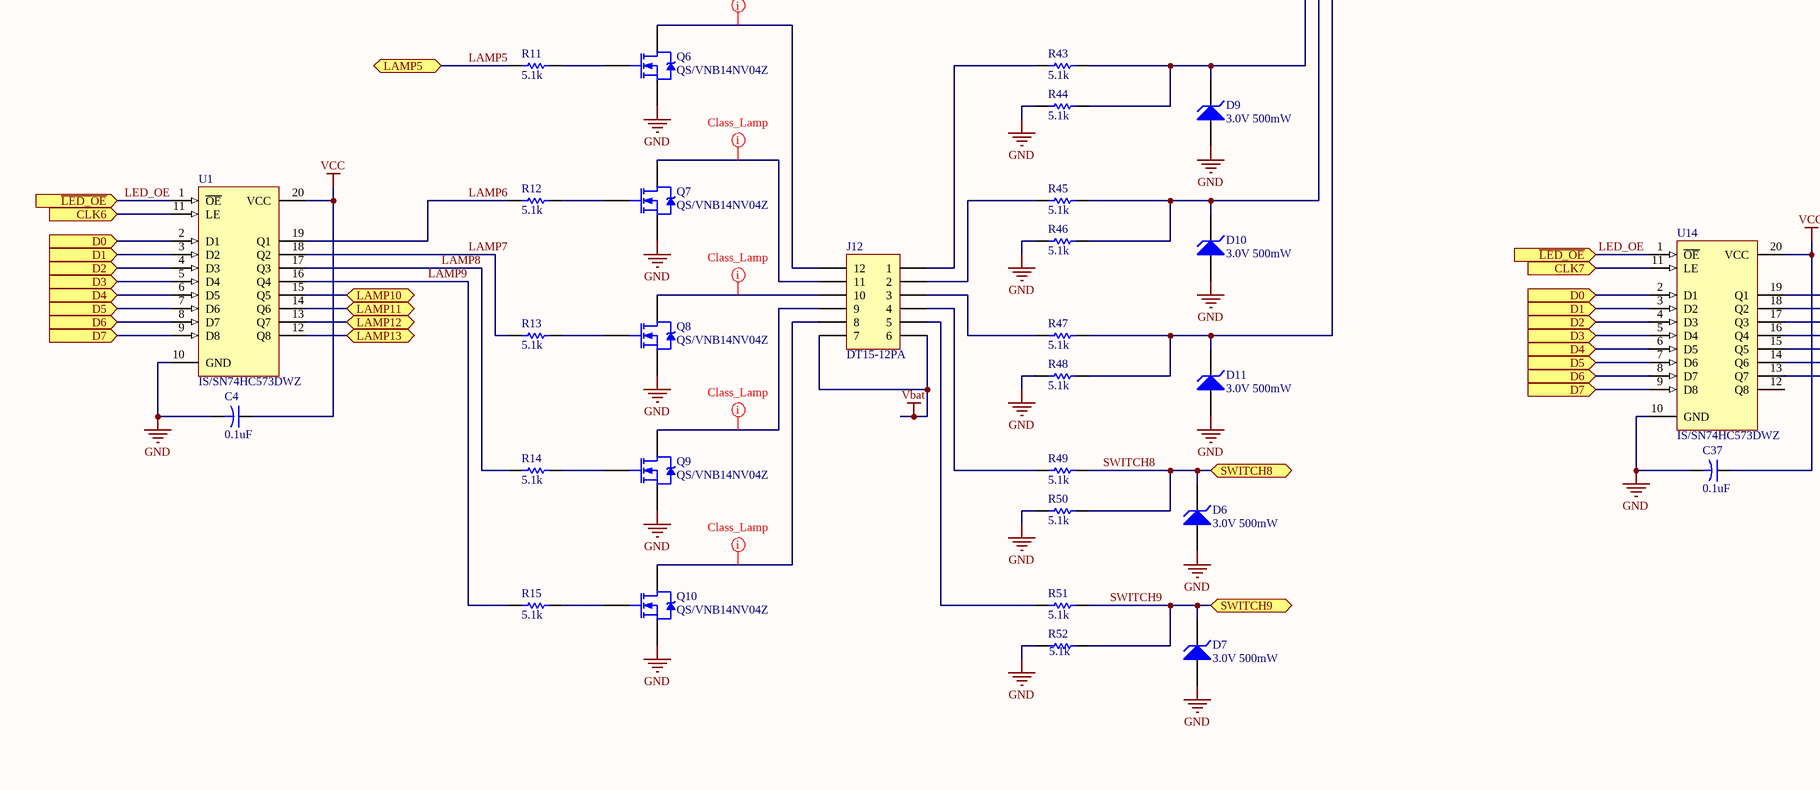
[diagram p10: ELC102 - Switch Interface.SchDoc, bottom left]
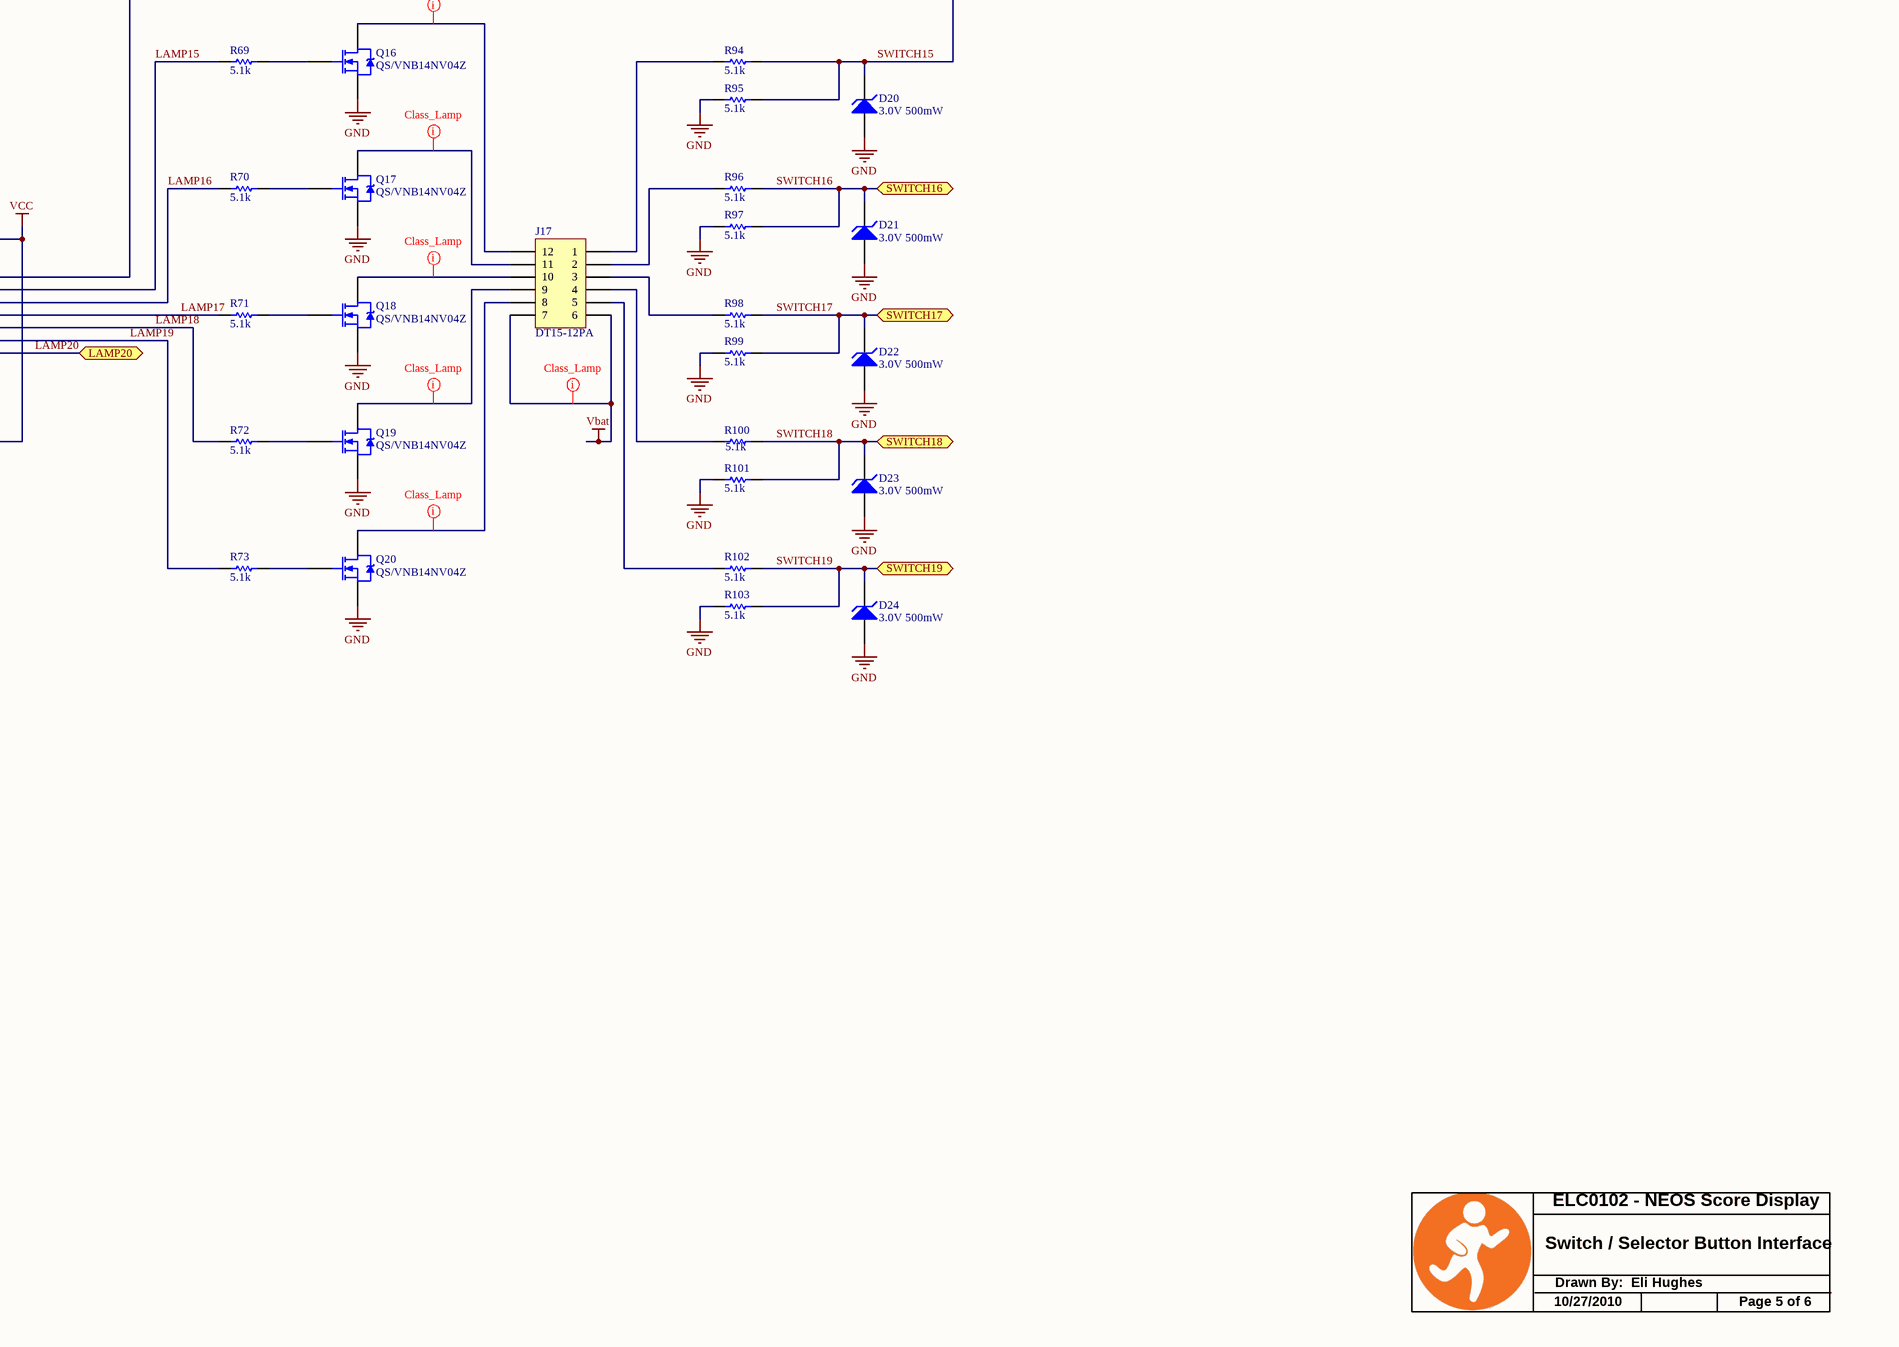
[diagram p11: ELC102 - Switch Interface.SchDoc, bottom right]

### Parts
C4  0.1uF  [C0805]
C30  0.1uF  [C0805]
C37  0.1uF  [C0805]
C46  0.1uF  [C0805]
D3  3.0V 500mW  [SOD123]
D4  3.0V 500mW  [SOD123]
D5  3.0V 500mW  [SOD123]
D6  3.0V 500mW  [SOD123]
D7  3.0V 500mW  [SOD123]
D8  3.0V 500mW  [SOD123]
D9  3.0V 500mW  [SOD123]
D10  3.0V 500mW  [SOD123]
D11  3.0V 500mW  [SOD123]
D15  3.0V 500mW  [SOD123]
D16  3.0V 500mW  [SOD123]
D17  3.0V 500mW  [SOD123]
D18  3.0V 500mW  [SOD123]
D19  3.0V 500mW  [SOD123]
D20  3.0V 500mW  [SOD123]
D21  3.0V 500mW  [SOD123]
D22  3.0V 500mW  [SOD123]
D23  3.0V 500mW  [SOD123]
D24  3.0V 500mW  [SOD123]
D25  3.0V 500mW  [SOD123]
J11  DT15-12PA  [JDT1512PA00Z]
J12  DT15-12PA  [JDT1512PA00Z]
J16  DT15-12PA  [JDT1512PA00Z]
J17  DT15-12PA  [JDT1512PA00Z]
Q1  QS/VNB14NV04Z  [D2PAK]
Q2  QS/VNB14NV04Z  [D2PAK]
Q3  QS/VNB14NV04Z  [D2PAK]
Q4  QS/VNB14NV04Z  [D2PAK]
Q5  QS/VNB14NV04Z  [D2PAK]
Q6  QS/VNB14NV04Z  [D2PAK]
Q7  QS/VNB14NV04Z  [D2PAK]
Q8  QS/VNB14NV04Z  [D2PAK]
Q9  QS/VNB14NV04Z  [D2PAK]
Q10  QS/VNB14NV04Z  [D2PAK]
Q11  QS/VNB14NV04Z  [D2PAK]
Q12  QS/VNB14NV04Z  [D2PAK]
Q13  QS/VNB14NV04Z  [D2PAK]
Q14  QS/VNB14NV04Z  [D2PAK]
Q15  QS/VNB14NV04Z  [D2PAK]
Q16  QS/VNB14NV04Z  [D2PAK]
Q17  QS/VNB14NV04Z  [D2PAK]
Q18  QS/VNB14NV04Z  [D2PAK]
Q19  QS/VNB14NV04Z  [D2PAK]
Q20  QS/VNB14NV04Z  [D2PAK]
R6  5.1k  [R0805]
R7  5.1k  [R0805]
R8  5.1k  [R0805]
R9  5.1k  [R0805]
R10  5.1k  [R0805]
R11  5.1k  [R0805]
R12  5.1k  [R0805]
R13  5.1k  [R0805]
R14  5.1k  [R0805]
R15  5.1k  [R0805]
R33  5.1k  [R0805]
R34  5.1k  [R0805]
R35  5.1k  [R0805]
R36  5.1k  [R0805]
R37  5.1k  [R0805]
R38  5.1k  [R0805]
R39  5.1k  [R0805]
R40  5.1k  [R0805]
R41  5.1k  [R0805]
R42  5.1k  [R0805]
R43  5.1k  [R0805]
R44  5.1k  [R0805]
R45  5.1k  [R0805]
R46  5.1k  [R0805]
R47  5.1k  [R0805]
R48  5.1k  [R0805]
R49  5.1k  [R0805]
R50  5.1k  [R0805]
R51  5.1k  [R0805]
R52  5.1k  [R0805]
R55  5.1k  [R0805]
R62  5.1k  [R0805]
R63  5.1k  [R0805]
R64  5.1k  [R0805]
R65  5.1k  [R0805]
R66  5.1k  [R0805]
R69  5.1k  [R0805]
R70  5.1k  [R0805]
R71  5.1k  [R0805]
R72  5.1k  [R0805]
R73  5.1k  [R0805]
R84  5.1k  [R0805]
R85  5.1k  [R0805]
R86  5.1k  [R0805]
R87  5.1k  [R0805]
R88  5.1k  [R0805]
R89  5.1k  [R0805]
R90  5.1k  [R0805]
R91  5.1k  [R0805]
R92  5.1k  [R0805]
R93  5.1k  [R0805]
R94  5.1k  [R0805]
R95  5.1k  [R0805]
R96  5.1k  [R0805]
R97  5.1k  [R0805]
R98  5.1k  [R0805]
R99  5.1k  [R0805]
R100  5.1k  [R0805]
R101  5.1k  [R0805]
R102  5.1k  [R0805]
R103  5.1k  [R0805]
R104  5.1k  [R0805]
U1  IS/SN74HC573DWZ  [SOIC300-20]
U10  IS/SN74HC541DWZ  [SOIC300-20]
U14  IS/SN74HC573DWZ  [SOIC300-20]
U18  IS/SN74HC541DWZ  [SOIC300-20]

### Ports
CLK6 (in), CLK7 (in), D0, D0 (in), D1, D1 (in), D2, D2 (in), D3, D3 (in), D4, D4 (in), D5, D5 (in), D6, D6 (in), D7, D7 (in), LAMP0, LAMP1, LAMP2, LAMP3, LAMP4, LAMP5, LAMP10, LAMP11, LAMP12, LAMP13, LAMP20, SWITCH8, SWITCH9, SWITCH16, SWITCH17, SWITCH18, SWITCH19, SWITCHES0-7, SWITCHES8-15, ~{LED_OE} (in)

### Nets
GND: C4.2 C30.2 C37.2 C46.2 D3.1(A) D4.1(A) D5.1(A) D6.1(A) D7.1(A) D8.1(A) D9.1(A) D10.1(A) D11.1(A) D15.1(A) D16.1(A) D17.1(A) D18.1(A) D19.1(A) D20.1(A) D21.1(A) D22.1(A) D23.1(A) D24.1(A) D25.1(A) Q1.3(S) Q2.3(S) Q3.3(S) Q4.3(S) Q5.3(S) Q6.3(S) Q7.3(S) Q8.3(S) Q9.3(S) Q10.3(S) Q11.3(S) Q12.3(S) Q13.3(S) Q14.3(S) Q15.3(S) Q16.3(S) Q17.3(S) Q18.3(S) Q19.3(S) Q20.3(S) R34.2 R36.2 R38.2 R40.2 R42.2 R44.2 R46.2 R48.2 R50.2 R52.2 R85.2 R87.2 R89.2 R91.2 R93.2 R95.2 R97.2 R99.2 R101.2 R103.2 U1.10(GND) U10.10(GND) U14.10(GND) U18.10(GND)
Vbat: J11.6 J11.7 J12.6 J12.7 J16.6 J16.7 J17.6 J17.7
VCC: C4.1 C30.1 C37.1 C46.1 R55.1 R104.1 U1.20(VCC) U10.20(VCC) U14.20(VCC) U18.20(VCC)  [project net +3.3 VDC]
CLK6: U1.11(LE) ; port CLK6
CLK7: U14.11(LE) ; port CLK7
D0: U1.2(D1) U10.18(Y1) U14.2(D1) U18.18(Y1) ; port D0
D1: U1.3(D2) U10.17(Y2) U14.3(D2) U18.17(Y2) ; port D1
D2: U1.4(D3) U10.16(Y3) U14.4(D3) U18.16(Y3) ; port D2
D3: U1.5(D4) U10.15(Y4) U14.5(D4) U18.15(Y4) ; port D3
D4: U1.6(D5) U10.14(Y5) U14.6(D5) U18.14(Y5) ; port D4
D5: U1.7(D6) U10.13(Y6) U14.7(D6) U18.13(Y6) ; port D5
D6: U1.8(D7) U10.12(Y7) U14.8(D7) U18.12(Y7) ; port D6
D7: U1.9(D8) U10.11(Y8) U14.9(D8) U18.11(Y8) ; port D7
LAMP0: R6.1 ; port LAMP0
LAMP1: R7.1 ; port LAMP1
LAMP2: R8.1 ; port LAMP2
LAMP3: R9.1 ; port LAMP3
LAMP4: R10.1 ; port LAMP4
LAMP5: R11.1 ; port LAMP5
LAMP6: R12.1 U1.19(Q1)
LAMP7: R13.1 U1.18(Q2)
LAMP8: R14.1 U1.17(Q3)
LAMP9: R15.1 U1.16(Q4)
LAMP10: R62.1 U1.15(Q5) ; port LAMP10
LAMP11: R63.1 U1.14(Q6) ; port LAMP11
LAMP12: R64.1 U1.13(Q7) ; port LAMP12
LAMP13: R65.1 U1.12(Q8) ; port LAMP13
LAMP14: R66.1 U14.19(Q1)
LAMP15: R69.1 U14.18(Q2)
LAMP16: R70.1 U14.17(Q3)
LAMP17: R71.1 U14.16(Q4)
LAMP18: R72.1 U14.15(Q5)
LAMP19: R73.1 U14.14(Q6)
LAMP20: U14.13(Q7) ; port LAMP20
LED_OE: U1.1(~{OE}) U14.1(~{OE}) ; port ~{LED_OE}
SWITCH0: D3.2(K) R33.1 R34.1 U10.2(A1)
SWITCH1: D4.2(K) R35.1 R36.1 U10.3(A2)
SWITCH2: D5.2(K) R37.1 R38.1 U10.4(A3)
SWITCH3: D25.2(K) R39.1 R40.1 U10.5(A4)
SWITCH4: D8.2(K) R41.1 R42.1 U10.6(A5)
SWITCH5: D9.2(K) R43.1 R44.1 U10.7(A6)
SWITCH6: D10.2(K) R45.1 R46.1 U10.8(A7)
SWITCH7: D11.2(K) R47.1 R48.1 U10.9(A8)
SWITCH8: D6.2(K) R49.1 R50.1 U18.2(A1) ; port SWITCH8
SWITCH9: D7.2(K) R51.1 R52.1 U18.3(A2) ; port SWITCH9
SWITCH10: D15.2(K) R84.1 R85.1 U18.4(A3)
SWITCH11: D16.2(K) R86.1 R87.1 U18.5(A4)
SWITCH12: D17.2(K) R88.1 R89.1 U18.6(A5)
SWITCH13: D18.2(K) R90.1 R91.1 U18.7(A6)
SWITCH14: D19.2(K) R92.1 R93.1 U18.8(A7)
SWITCH15: D20.2(K) R94.1 R95.1 U18.9(A8)
SWITCH16: D21.2(K) R96.1 R97.1 ; port SWITCH16
SWITCH17: D22.2(K) R98.1 R99.1 ; port SWITCH17
SWITCH18: D23.2(K) R100.1 R101.1 ; port SWITCH18
SWITCH19: D24.2(K) R102.1 R103.1 ; port SWITCH19
SWITCHES0-7: R55.2 U10.1(~{OE}1) U10.19(~{OE}2) ; port SWITCHES0-7
SWITCHES8-15: R104.2 U18.1(~{OE}1) U18.19(~{OE}2) ; port SWITCHES8-15
NetJ11_1: J11.1 R33.2
NetJ11_2: J11.2 R35.2
NetJ11_3: J11.3 R37.2
NetJ11_4: J11.4 R39.2
NetJ11_5: J11.5 R41.2
NetJ11_8: J11.8 Q5.2(D)
NetJ11_9: J11.9 Q4.2(D)
NetJ11_10: J11.10 Q3.2(D)
NetJ11_11: J11.11 Q2.2(D)
NetJ11_12: J11.12 Q1.2(D)
NetJ12_1: J12.1 R43.2
NetJ12_2: J12.2 R45.2
NetJ12_3: J12.3 R47.2
NetJ12_4: J12.4 R49.2
NetJ12_5: J12.5 R51.2
NetJ12_8: J12.8 Q10.2(D)
NetJ12_9: J12.9 Q9.2(D)
NetJ12_10: J12.10 Q8.2(D)
NetJ12_11: J12.11 Q7.2(D)
NetJ12_12: J12.12 Q6.2(D)
NetJ16_1: J16.1 R84.2
NetJ16_2: J16.2 R86.2
NetJ16_3: J16.3 R88.2
NetJ16_4: J16.4 R90.2
NetJ16_5: J16.5 R92.2
NetJ16_8: J16.8 Q15.2(D)
NetJ16_9: J16.9 Q14.2(D)
NetJ16_10: J16.10 Q13.2(D)
NetJ16_11: J16.11 Q12.2(D)
NetJ16_12: J16.12 Q11.2(D)
NetJ17_1: J17.1 R94.2
NetJ17_2: J17.2 R96.2
NetJ17_3: J17.3 R98.2
NetJ17_4: J17.4 R100.2
NetJ17_5: J17.5 R102.2
NetJ17_8: J17.8 Q20.2(D)
NetJ17_9: J17.9 Q19.2(D)
NetJ17_10: J17.10 Q18.2(D)
NetJ17_11: J17.11 Q17.2(D)
NetJ17_12: J17.12 Q16.2(D)
NetQ1_1: Q1.1(G) R6.2
NetQ2_1: Q2.1(G) R7.2
NetQ3_1: Q3.1(G) R8.2
NetQ4_1: Q4.1(G) R9.2
NetQ5_1: Q5.1(G) R10.2
NetQ6_1: Q6.1(G) R11.2
NetQ7_1: Q7.1(G) R12.2
NetQ8_1: Q8.1(G) R13.2
NetQ9_1: Q9.1(G) R14.2
NetQ10_1: Q10.1(G) R15.2
NetQ11_1: Q11.1(G) R62.2
NetQ12_1: Q12.1(G) R63.2
NetQ13_1: Q13.1(G) R64.2
NetQ14_1: Q14.1(G) R65.2
NetQ15_1: Q15.1(G) R66.2
NetQ16_1: Q16.1(G) R69.2
NetQ17_1: Q17.1(G) R70.2
NetQ18_1: Q18.1(G) R71.2
NetQ19_1: Q19.1(G) R72.2
NetQ20_1: Q20.1(G) R73.2

Not connected (* = marked no-connect by the designer): U14 12(Q8)

### Layout directives
net class Class_Lamp: NetJ11_8, NetJ11_9, NetJ11_10, NetJ11_11, NetJ11_12, NetJ12_8, NetJ12_9, NetJ12_10, NetJ12_11, NetJ12_12, NetJ16_8, NetJ16_9, NetJ16_10, NetJ16_11, NetJ16_12, NetJ17_8, NetJ17_9, NetJ17_10, NetJ17_11, NetJ17_12, Vbat

### Notes on the sheet
- Switch / Selector Button Interface
- ELC0102 - NEOS Score Display
- 10/27/2010
- Drawn By:  Eli Hughes
- Page 5 of 6

### Library data of the parts
C4 C30 C37 C46 = CS/C0805C104K5RACK: Kemet .1uF 0805; Manufacturer Part Number: C0805C104K5RACTU; Source Part Number: 399-1170-2-ND; Description: CAP .10UF 50V CERAMIC X7R 0805; Capacitance: 0.1µF; Voltage - Rated: 50V; Tolerance: ±10%; Temperature Coefficient: X7R; Manufacturer: Kemet; ROHS Certificate: Lead free / RoHS compliant; Source: Digikey; Value: 0.1uF; Supplier 1: Digi-Key; RoHS: RoHS Compliant; Category: Capacitors; Stock 1: 10120790; Pricing 1: 10=0.105, 100=0.0378, 250=0.02732, 500=0.02016, 1000=0.01365 (USD); Mounting Type: Surface Mount, MLCC; Operating Temperature: -55°C ~ 125°C; Features: -; Applications: General Purpose; Ratings: -; Package / Case: 0805 (2012 Metric); Size / Dimension: 0.079" L x 0.049" W (2.00mm x 1.25mm); Lead Spacing: -; Thickness: 0.90mm; Packaging: Cut Tape (CT); Lead Style: -; ComponentLink1URL: http://www.kemet.com/datasheets&C0805C104K5RACTU; ComponentLink1Description: http://www.kemet.com/datasheets&C0805C104K5RACTU; Supplier Part Number 1: 399-1170-1-ND
D3-D11 D15-D25 = DS/MMSZ5225BT1Z: Zener 3.0V SOD-123; Manufacturer: ON Semiconductor; Manufacturer Part Number: MMSZ5225BT1G; Source Part Number: MMSZ5225BT1GOSCT-ND; Value: MMSZ5225BT1G; Description: DIODE ZENER 3V 500MW SOD-123; Voltage - Zener (Nom) (Vz): 3V; Voltage - Forward (Vf) (Max) @ If: 900mV @ 10mA; Current - Reverse Leakage @ Vr: 50µA @ 1V; Tolerance: ±5%; Impedance (Max) (Zzt): 29 Ohm; ROHS Certificate: Lead free / RoHS compliant; Source: Digikey; Supplier 1: Digi-Key; RoHS: RoHS Compliant; Category: Discrete Semiconductor Products; Stock 1: 27337; Pricing 1: 1=0.52, 10=0.356, 100=0.1676, 250=0.1194, 500=0.09114, 1000=0.06285 (USD); Power - Max: 500mW; Mounting Type: Surface Mount; Package / Case: SOD-123; Packaging: Cut Tape (CT); Operating Temperature: -55°C ~ 150°C; Supplier Device Package: SOD-123; ComponentLink1URL: http://www.onsemi.com/pub_link/Collateral/MMSZ5221BT1-D.PDF; ComponentLink1Description: http://www.onsemi.com/pub_link/Collateral/MMSZ5221BT1-D.PDF; Supplier Part Number 1: MMSZ5225BT1GOSCT-ND
J11 J12 J16 J17 = JDT1512PA00Z: Deutsch 12P Sealed PCB connector; Manufacturer: Deutsch; Manufacturer Part Number: DT15-12PA; ROHS Certificate: ROHS Compliant; Value: DT15-12PA; Supplier 1: LADD Industries Inc.; Supplier Part Number 1: DT15-12PA
Q1-Q20 = QS/VNB14NV04Z: HEXFET Power MOSFET; Manufacturer: STMicroelectronics; Source Part Number: VNB14NV04-ND; Description: MOSFET POWER 40V 12A D2PAK; Type: Low Side; Input Type: Non-Inverting; Number of Outputs: 1; On-State Resistance: 35 mOhm; Current - Peak Output: 18A; Manufacturer Part Number: VNB14NV04; ROHS Certificate: Lead free / RoHS compliant; Source: Digikey; Value: VNB14NV04; Supplier 1: Digi-Key; RoHS: RoHS Compliant; Category: Integrated Circuits (ICs); Stock 1: 0; Pricing 1: 800=1.5495 (USD); Current - Output / Channel: -; Voltage - Supply: -; Operating Temperature: -; Mounting Type: Surface Mount; Package / Case: TO-263-2, D²Pak (2 leads + Tab), TO-263AB; Packaging: Tube; Supplier Device Package: *; ComponentLink1URL: http://www.st.com/stonline/products/literature/ds/1643/vnb14n04.pdf; ComponentLink1Description: http://www.st.com/stonline/products/literature/ds/1643/vnb14n04.pdf; Supplier Part Number 1: VNB14NV04-ND
R6-R15 R33-R52 R55 R62-R66 R69-R73 R84-R104 = ERJ-6ENF5101V: as R105-R107 on sheet ELC102 - Red Digits; ComponentLink1Description: http://industrial.panasonic.com/www-cgi/jvcr13pz.cgi?E+PZ+3+AOA0002+ERJ6ENF5101V+7+WW; ComponentLink1URL: http://industrial.panasonic.com/www-cgi/jvcr13pz.cgi?E+PZ+3+AOA0002+ERJ6ENF5101V+7+WW; Value: 5.1k; Supplier 1: Digi-Key; Manufacturer Part Number: ERJ-6ENF5101V; RoHS: RoHS Compliant; Category: Resistors; Stock 1: 32293; Pricing 1: 1=0.07, 50=0.0276, 100=0.021, 250=0.0156, 500=0.01152, 1000=0.00768 (USD); Resistance In Ohms: 5.10K; Composition: Thick Film; Features: -; Tolerance: ±1%; Case: 0805 (2012 metric); Size / Dimension: 0.079" L x 0.049" W (2.00mm x 1.25mm); Height: 0.024" (0.60mm); Lead Style: Surface Mount (SMD - SMT); Packaging: Digi-Reel®; Supplier Part Number 1: P5.10KCDKR-ND
U1 U14 = IS/SN74HC573DWZ: as U19-U21 on sheet ELC102 - Red Digits; ROHS Certificate: Lead free / RoHS compliant; Source: Digikey; Supplier 1: Digi-Key; RoHS: RoHS Compliant; Category: Integrated Circuits (ICs); Stock 1: 46803; Pricing 1: 1=0.84, 25=0.646, 100=0.57, 250=0.494, 500=0.418 (USD); Logic Type: D-Type Transparent Latch; Operating Temperature: -40°C ~ 125°C; Mounting Type: Surface Mount; Package / Case: 20-SOIC (0.300", 7.50mm Width); Packaging: Cut Tape (CT); Supplier Device Package: 20-SOIC; ComponentLink1URL: http://www.nxp.com/documents/data_sheet/74HC_HCT573.pdf; ComponentLink1Description: http://www.nxp.com/documents/data_sheet/74HC_HCT573.pdf; Supplier Part Number 1: 568-1477-1-ND
U10 U18 = IS/SN74HC541DWZ: Octal Buffer and Line Driver with 3-State Outputs; Manufacturer: Texas Instruments; Manufacturer Part Number: SN74HC541DWR; Source Part Number: 296-1202-2-ND; Value: SN74HC541DWR; Description: IC BUFF/DVR TRI-ST 8BIT 20SOIC; Logic Type: Buffer/Line Driver, Non-Inverting; Number of Elements: 1; Number of Bits per Element: 8; Current - Output High, Low: 7.8mA, 7.8mA; Voltage - Supply: 2 V ~ 6 V; ROHS Certificate: Lead free / RoHS compliant; Source: Digikey; Supplier 1: Digi-Key; RoHS: RoHS Compliant; Category: Integrated Circuits (ICs); Stock 1: 8100; Pricing 1: 1=0.72, 25=0.5004, 100=0.429, 250=0.37052, 500=0.3185, 1000=0.247 (USD); Operating Temperature: -40°C ~ 85°C; Mounting Type: Surface Mount; Package / Case: 20-SOIC (0.300", 7.50mm Width); Packaging: Cut Tape (CT); Supplier Device Package: *; ComponentLink1URL: http://focus.ti.com/lit/ds/symlink/sn74hc541.pdf; ComponentLink1Description: http://focus.ti.com/lit/ds/symlink/sn74hc541.pdf; Supplier Part Number 1: 296-1202-1-ND

## Sheet ELC102 - Assembly Notes.SchDoc: ELC102 - NEOS Scoreboard
size Tabloid
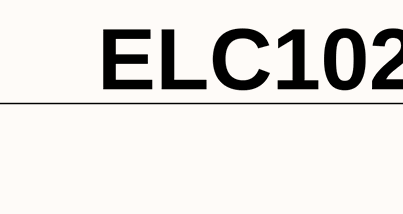
[diagram p12: ELC102 - Assembly Notes.SchDoc, top left]
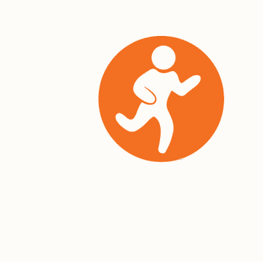
[diagram p13: ELC102 - Assembly Notes.SchDoc, top right]
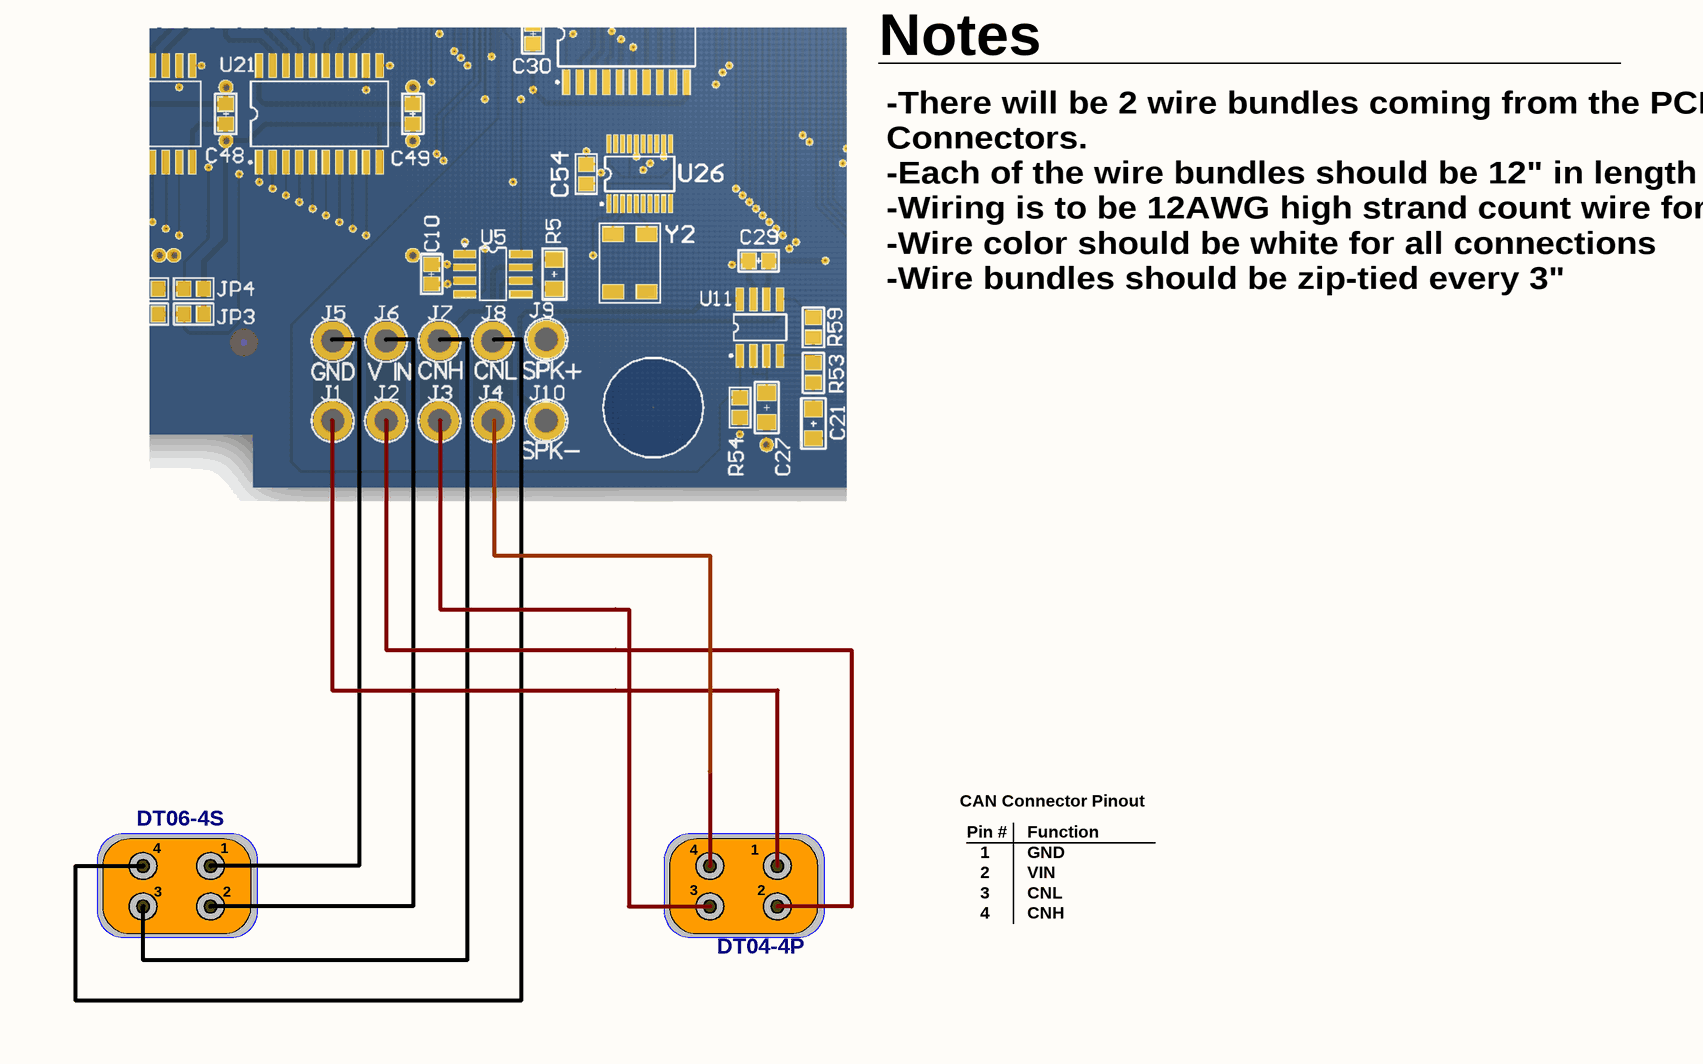
[diagram p14: ELC102 - Assembly Notes.SchDoc, bottom left]
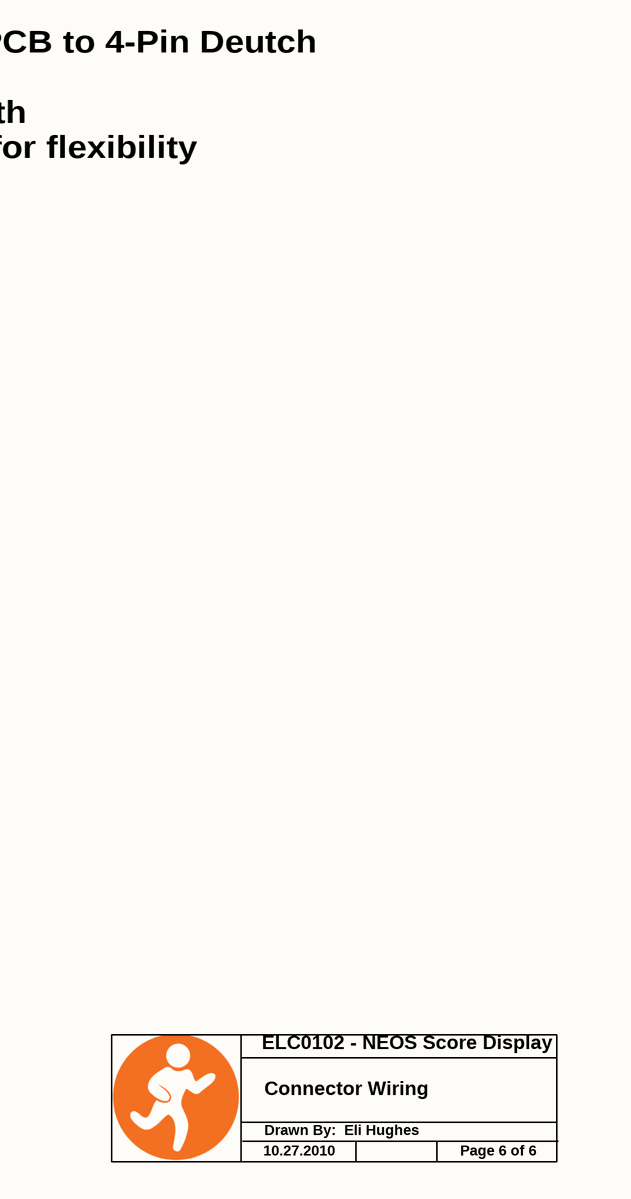
[diagram p15: ELC102 - Assembly Notes.SchDoc, bottom middle]

### Notes on the sheet
- ELC102 - Score Display - Wiring
- Notes
- -There will be 2 wire bundles coming from the PCB to 4-Pin Deutch Connectors.
  -Each of the wire bundles should be 12" in length
  -Wiring is to be 12AWG high strand count wire for flexibility
  -Wire color should be white for all connections
  -Wire bundles should be zip-tied every 3"
- DT06-4S
- 4
- 1
- CAN Connector Pinout
- Pin #
- Function
- GND
- 3
- 2
- VIN
- CNL
- CNH
- DT04-4P
- ELC0102 - NEOS Score Display
- Connector Wiring
- Drawn By:  Eli Hughes
- 10.27.2010
- Page 6 of 6

## Nets that join several sheets
+3.3 VDC: ELC102 - ScoreBoard - TopLevel (20 pins), ELC102 - Old Circuits (32 pins), ELC102 - Green Digits (6 pins), ELC102 - Red Digits (6 pins), ELC102 - Switch Interface (10 pins)
+5 VDC: ELC102 - ScoreBoard - TopLevel (C32.1 U12.3), ELC102 - Old Circuits (7 pins)
GND: ELC102 - ScoreBoard - TopLevel (37 pins), ELC102 - Old Circuits (49 pins), ELC102 - Green Digits (27 pins), ELC102 - Red Digits (27 pins), ELC102 - Switch Interface (68 pins)
Vbat: ELC102 - ScoreBoard - TopLevel (D1.A J2.1 J6.1), ELC102 - Switch Interface (8 pins)
Vin: ELC102 - ScoreBoard - TopLevel (8 pins), ELC102 - Old Circuits (R67.1)
8V: ELC102 - ScoreBoard - TopLevel (6 pins), ELC102 - Green Digits (42 pins), ELC102 - Red Digits (42 pins)
AUDIO_SHUTDOWN: ELC102 - ScoreBoard - TopLevel (U3.46), ELC102 - Old Circuits (R54.1 U11.1)
CLK0: ELC102 - ScoreBoard - TopLevel (U25.15), ELC102 - Red Digits (U19.11)
CLK1: ELC102 - ScoreBoard - TopLevel (U25.14), ELC102 - Red Digits (U20.11)
CLK2: ELC102 - ScoreBoard - TopLevel (U25.13), ELC102 - Red Digits (U21.11)
CLK3: ELC102 - ScoreBoard - TopLevel (U25.12), ELC102 - Green Digits (U22.11)
CLK4: ELC102 - ScoreBoard - TopLevel (U25.11), ELC102 - Green Digits (U23.11)
CLK5: ELC102 - ScoreBoard - TopLevel (U25.10), ELC102 - Green Digits (U24.11)
CLK6: ELC102 - ScoreBoard - TopLevel (U25.9), ELC102 - Switch Interface (U1.11)
CLK7: ELC102 - ScoreBoard - TopLevel (U25.7), ELC102 - Switch Interface (U14.11)
COFS: ELC102 - ScoreBoard - TopLevel (U3.1), ELC102 - Old Circuits (U4.3)
CSCK: ELC102 - ScoreBoard - TopLevel (U3.78), ELC102 - Old Circuits (U4.2)
CSDO: ELC102 - ScoreBoard - TopLevel (U3.80), ELC102 - Old Circuits (U4.1)
D0: ELC102 - ScoreBoard - TopLevel (U3.58), ELC102 - Old Circuits (R20.1), ELC102 - Green Digits (U22.2 U23.2 U24.2), ELC102 - Red Digits (U19.2 U20.2 U21.2), ELC102 - Switch Interface (U1.2 U10.18 U14.2 U18.18)
D1: ELC102 - ScoreBoard - TopLevel (U3.61), ELC102 - Old Circuits (R21.1), ELC102 - Green Digits (U22.3 U23.3 U24.3), ELC102 - Red Digits (U19.3 U20.3 U21.3), ELC102 - Switch Interface (U1.3 U10.17 U14.3 U18.17)
D2: ELC102 - ScoreBoard - TopLevel (U3.62), ELC102 - Old Circuits (R22.1), ELC102 - Green Digits (U22.4 U23.4 U24.4), ELC102 - Red Digits (U19.4 U20.4 U21.4), ELC102 - Switch Interface (U1.4 U10.16 U14.4 U18.16)
D3: ELC102 - ScoreBoard - TopLevel (U3.63), ELC102 - Old Circuits (R23.1), ELC102 - Green Digits (U22.5 U23.5 U24.5), ELC102 - Red Digits (U19.5 U20.5 U21.5), ELC102 - Switch Interface (U1.5 U10.15 U14.5 U18.15)
D4: ELC102 - ScoreBoard - TopLevel (U3.66), ELC102 - Old Circuits (R24.1), ELC102 - Green Digits (U22.6 U23.6 U24.6), ELC102 - Red Digits (U19.6 U20.6 U21.6), ELC102 - Switch Interface (U1.6 U10.14 U14.6 U18.14)
D5: ELC102 - ScoreBoard - TopLevel (U3.67), ELC102 - Old Circuits (R25.1), ELC102 - Green Digits (U22.7 U23.7 U24.7), ELC102 - Red Digits (U19.7 U20.7 U21.7), ELC102 - Switch Interface (U1.7 U10.13 U14.7 U18.13)
D6: ELC102 - ScoreBoard - TopLevel (U3.68), ELC102 - Old Circuits (R26.1), ELC102 - Green Digits (U22.8 U23.8 U24.8), ELC102 - Red Digits (U19.8 U20.8 U21.8), ELC102 - Switch Interface (U1.8 U10.12 U14.8 U18.12)
D7: ELC102 - ScoreBoard - TopLevel (U3.69), ELC102 - Old Circuits (R27.1), ELC102 - Green Digits (U22.9 U23.9 U24.9), ELC102 - Red Digits (U19.9 U20.9 U21.9), ELC102 - Switch Interface (U1.9 U10.11 U14.9 U18.11)
~{FORCEOFF}: ELC102 - ScoreBoard - TopLevel (U3.28), ELC102 - Old Circuits (U15.16)
FORCEON: ELC102 - ScoreBoard - TopLevel (U3.27), ELC102 - Old Circuits (U15.12)
LAMP0: ELC102 - Red Digits (U19.12), ELC102 - Switch Interface (R6.1)
LAMP1: ELC102 - Red Digits (U20.12), ELC102 - Switch Interface (R7.1)
LAMP2: ELC102 - Red Digits (U21.12), ELC102 - Switch Interface (R8.1)
LAMP3: ELC102 - Green Digits (U22.12), ELC102 - Switch Interface (R9.1)
LAMP4: ELC102 - Green Digits (U23.12), ELC102 - Switch Interface (R10.1)
LAMP5: ELC102 - Green Digits (U24.12), ELC102 - Switch Interface (R11.1)
LAMP20: ELC102 - Old Circuits (R83.1), ELC102 - Switch Interface (U14.13)
LCD_CS1: ELC102 - ScoreBoard - TopLevel (U3.64), ELC102 - Old Circuits (R79.1)
LCD_CS2: ELC102 - ScoreBoard - TopLevel (U3.65), ELC102 - Old Circuits (R80.1)
LCD_D/I: ELC102 - ScoreBoard - TopLevel (U3.55), ELC102 - Old Circuits (R76.1)
LCD_E: ELC102 - ScoreBoard - TopLevel (U3.56), ELC102 - Old Circuits (R78.1)
LCD_R/W: ELC102 - ScoreBoard - TopLevel (U3.54), ELC102 - Old Circuits (R77.1)
LCD_RESET: ELC102 - ScoreBoard - TopLevel (U3.57), ELC102 - Old Circuits (R81.1)
LED_OE: ELC102 - ScoreBoard - TopLevel (R19.2 U3.38), ELC102 - Green Digits (U22.1 U23.1 U24.1), ELC102 - Red Digits (U19.1 U20.1 U21.1), ELC102 - Switch Interface (U1.1 U14.1)
LIGHT_SENSOR NEG: ELC102 - ScoreBoard - TopLevel (R233.2 R234.2), ELC102 - Old Circuits (J19.4)
LIGHT_SENSOR POS: ELC102 - ScoreBoard - TopLevel (R232.2), ELC102 - Old Circuits (J19.6)
MCLK: ELC102 - ScoreBoard - TopLevel (R32.1 U3.50), ELC102 - Old Circuits (U4.4)
MEM0: ELC102 - ScoreBoard - TopLevel (U3.13), ELC102 - Old Circuits (R4.1 U2.7)
MEM1: ELC102 - ScoreBoard - TopLevel (U3.14), ELC102 - Old Circuits (R16.1 U6.7)
MEM2: ELC102 - ScoreBoard - TopLevel (U3.52), ELC102 - Old Circuits (R31.1 U9.7)
MEM3: ELC102 - ScoreBoard - TopLevel (U3.53), ELC102 - Old Circuits (R58.1 U13.7)
MEM_SCK: ELC102 - ScoreBoard - TopLevel (U3.45), ELC102 - Old Circuits (U2.16 U6.16 U9.16 U13.16)
MEM_SDI: ELC102 - ScoreBoard - TopLevel (U3.44), ELC102 - Old Circuits (U2.8 U6.8 U9.8 U13.8)
MEM_SDO: ELC102 - ScoreBoard - TopLevel (U3.43), ELC102 - Old Circuits (U2.15 U6.15 U9.15 U13.15)
MEM_~{W}: ELC102 - ScoreBoard - TopLevel (U3.36), ELC102 - Old Circuits (5 pins)
OPT0: ELC102 - ScoreBoard - TopLevel (U3.76), ELC102 - Old Circuits (JP4.1 R74.1)
OPT1: ELC102 - ScoreBoard - TopLevel (U3.77), ELC102 - Old Circuits (JP3.1 R68.1)
OPT2: ELC102 - ScoreBoard - TopLevel (U3.23), ELC102 - Old Circuits (JP2.1 R61.1)
OPT3: ELC102 - ScoreBoard - TopLevel (U3.24), ELC102 - Old Circuits (JP1.1 R60.1)
~{RS232_INVALID}: ELC102 - ScoreBoard - TopLevel (U3.15), ELC102 - Old Circuits (U15.10)
RTC_CE: ELC102 - ScoreBoard - TopLevel (U3.10), ELC102 - Old Circuits (U26.12)
RTC_SCK: ELC102 - ScoreBoard - TopLevel (U3.6), ELC102 - Old Circuits (U26.14)
RTC_SDI: ELC102 - ScoreBoard - TopLevel (U3.7), ELC102 - Old Circuits (U26.16)
RTC_SDO: ELC102 - ScoreBoard - TopLevel (U3.8), ELC102 - Old Circuits (U26.15)
RXD_RS232: ELC102 - ScoreBoard - TopLevel (U3.42), ELC102 - Old Circuits (U15.9)
RXD_USB: ELC102 - ScoreBoard - TopLevel (U3.39), ELC102 - Old Circuits (U16.26)
SWITCH16: ELC102 - ScoreBoard - TopLevel (U3.2), ELC102 - Switch Interface (D21.2 R96.1 R97.1)
SWITCH17: ELC102 - ScoreBoard - TopLevel (U3.3), ELC102 - Switch Interface (D22.2 R98.1 R99.1)
SWITCH18: ELC102 - ScoreBoard - TopLevel (U3.59), ELC102 - Switch Interface (D23.2 R100.1 R101.1)
SWITCH19: ELC102 - ScoreBoard - TopLevel (U3.60), ELC102 - Switch Interface (D24.2 R102.1 R103.1)
SWITCHES0-7: ELC102 - ScoreBoard - TopLevel (U3.74), ELC102 - Switch Interface (R55.2 U10.1 U10.19)
SWITCHES8-15: ELC102 - ScoreBoard - TopLevel (U3.47), ELC102 - Switch Interface (R104.2 U18.1 U18.19)
TXD_RS233: ELC102 - ScoreBoard - TopLevel (U3.41), ELC102 - Old Circuits (U15.11)
TXD_USB: ELC102 - ScoreBoard - TopLevel (U3.40), ELC102 - Old Circuits (U16.25)
USB_RST: ELC102 - ScoreBoard - TopLevel (U3.75), ELC102 - Old Circuits (R82.1 U16.9)

## Assembly variants
MAIN_BUILD: not fitted C5 C6 C7 C12 C13 C14 C16 C18 C19 C21 C25 C27 C29 C33 C34 C35 C36 C38 C39 C40 C41 C42 C43 C44 C45 C54 D12 D13 D14 J14 J15 J18 J19 JP1 JP2 JP3 JP4 Q21 R1 R2 R4 R5 R16 R20 R21 R22 R23 R24 R25 R26 R27 R28 R30 R31 R53 R54 R58 R59 R60 R61 R67 R68 R74 R75 R76 R77 R78 R79 R80 R81 R82 R83 R232 R233 R234 U2 U4 U6 U9 U11 U13 U15 U16 U17 U26 Y2